# EAGLE schematic SB V1.2 (EAGLE 9.6.2)

## Sheet 1 of 2
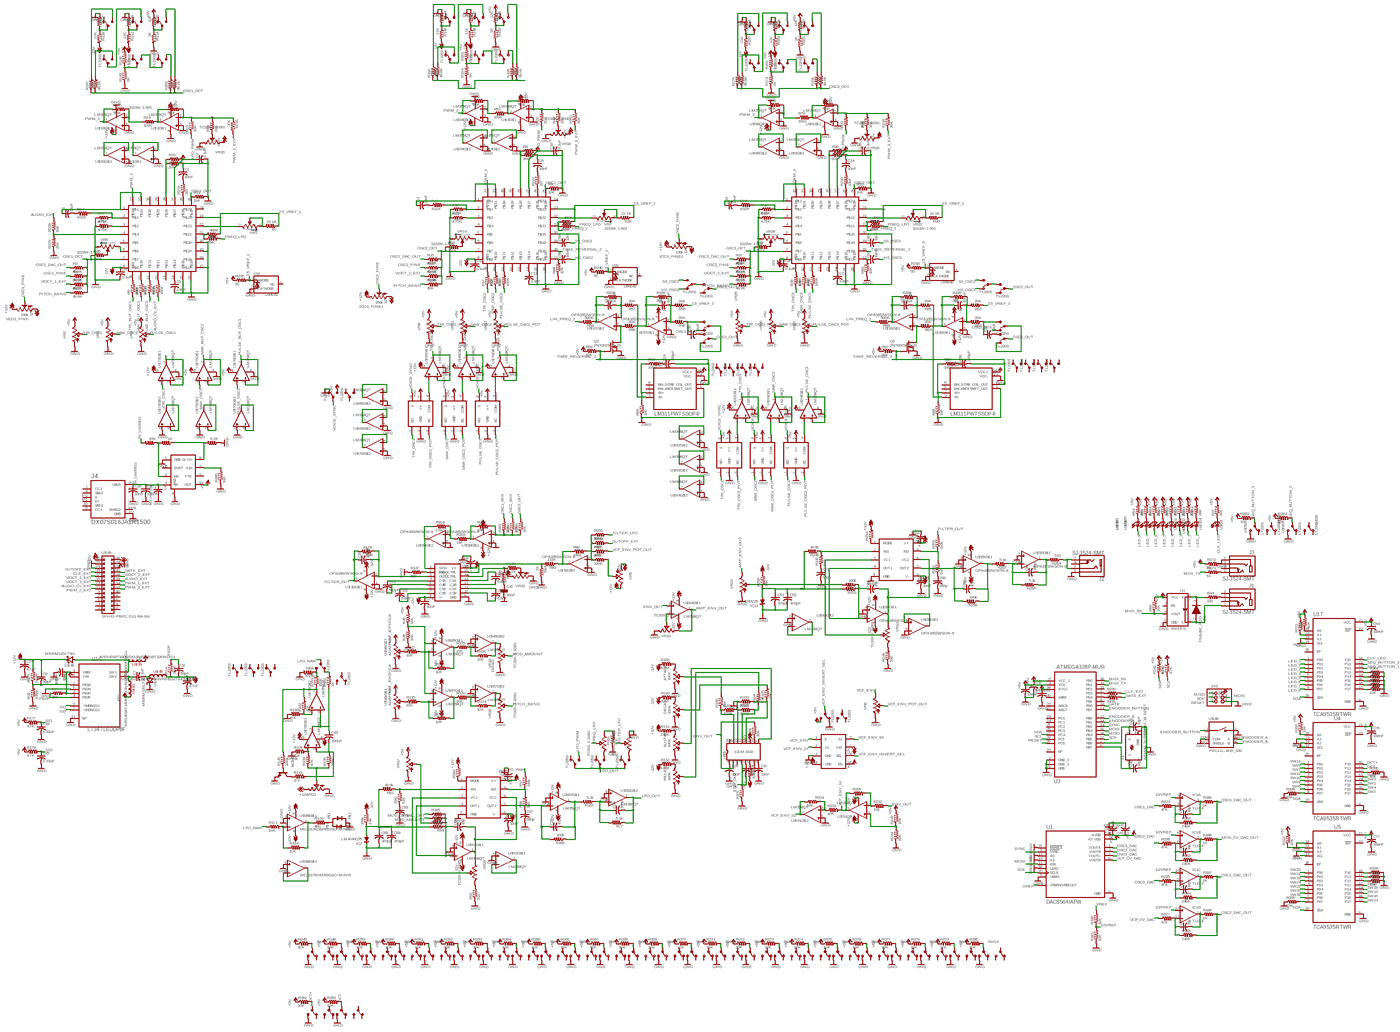
[diagram p0: schematic, sheet 1, overview]
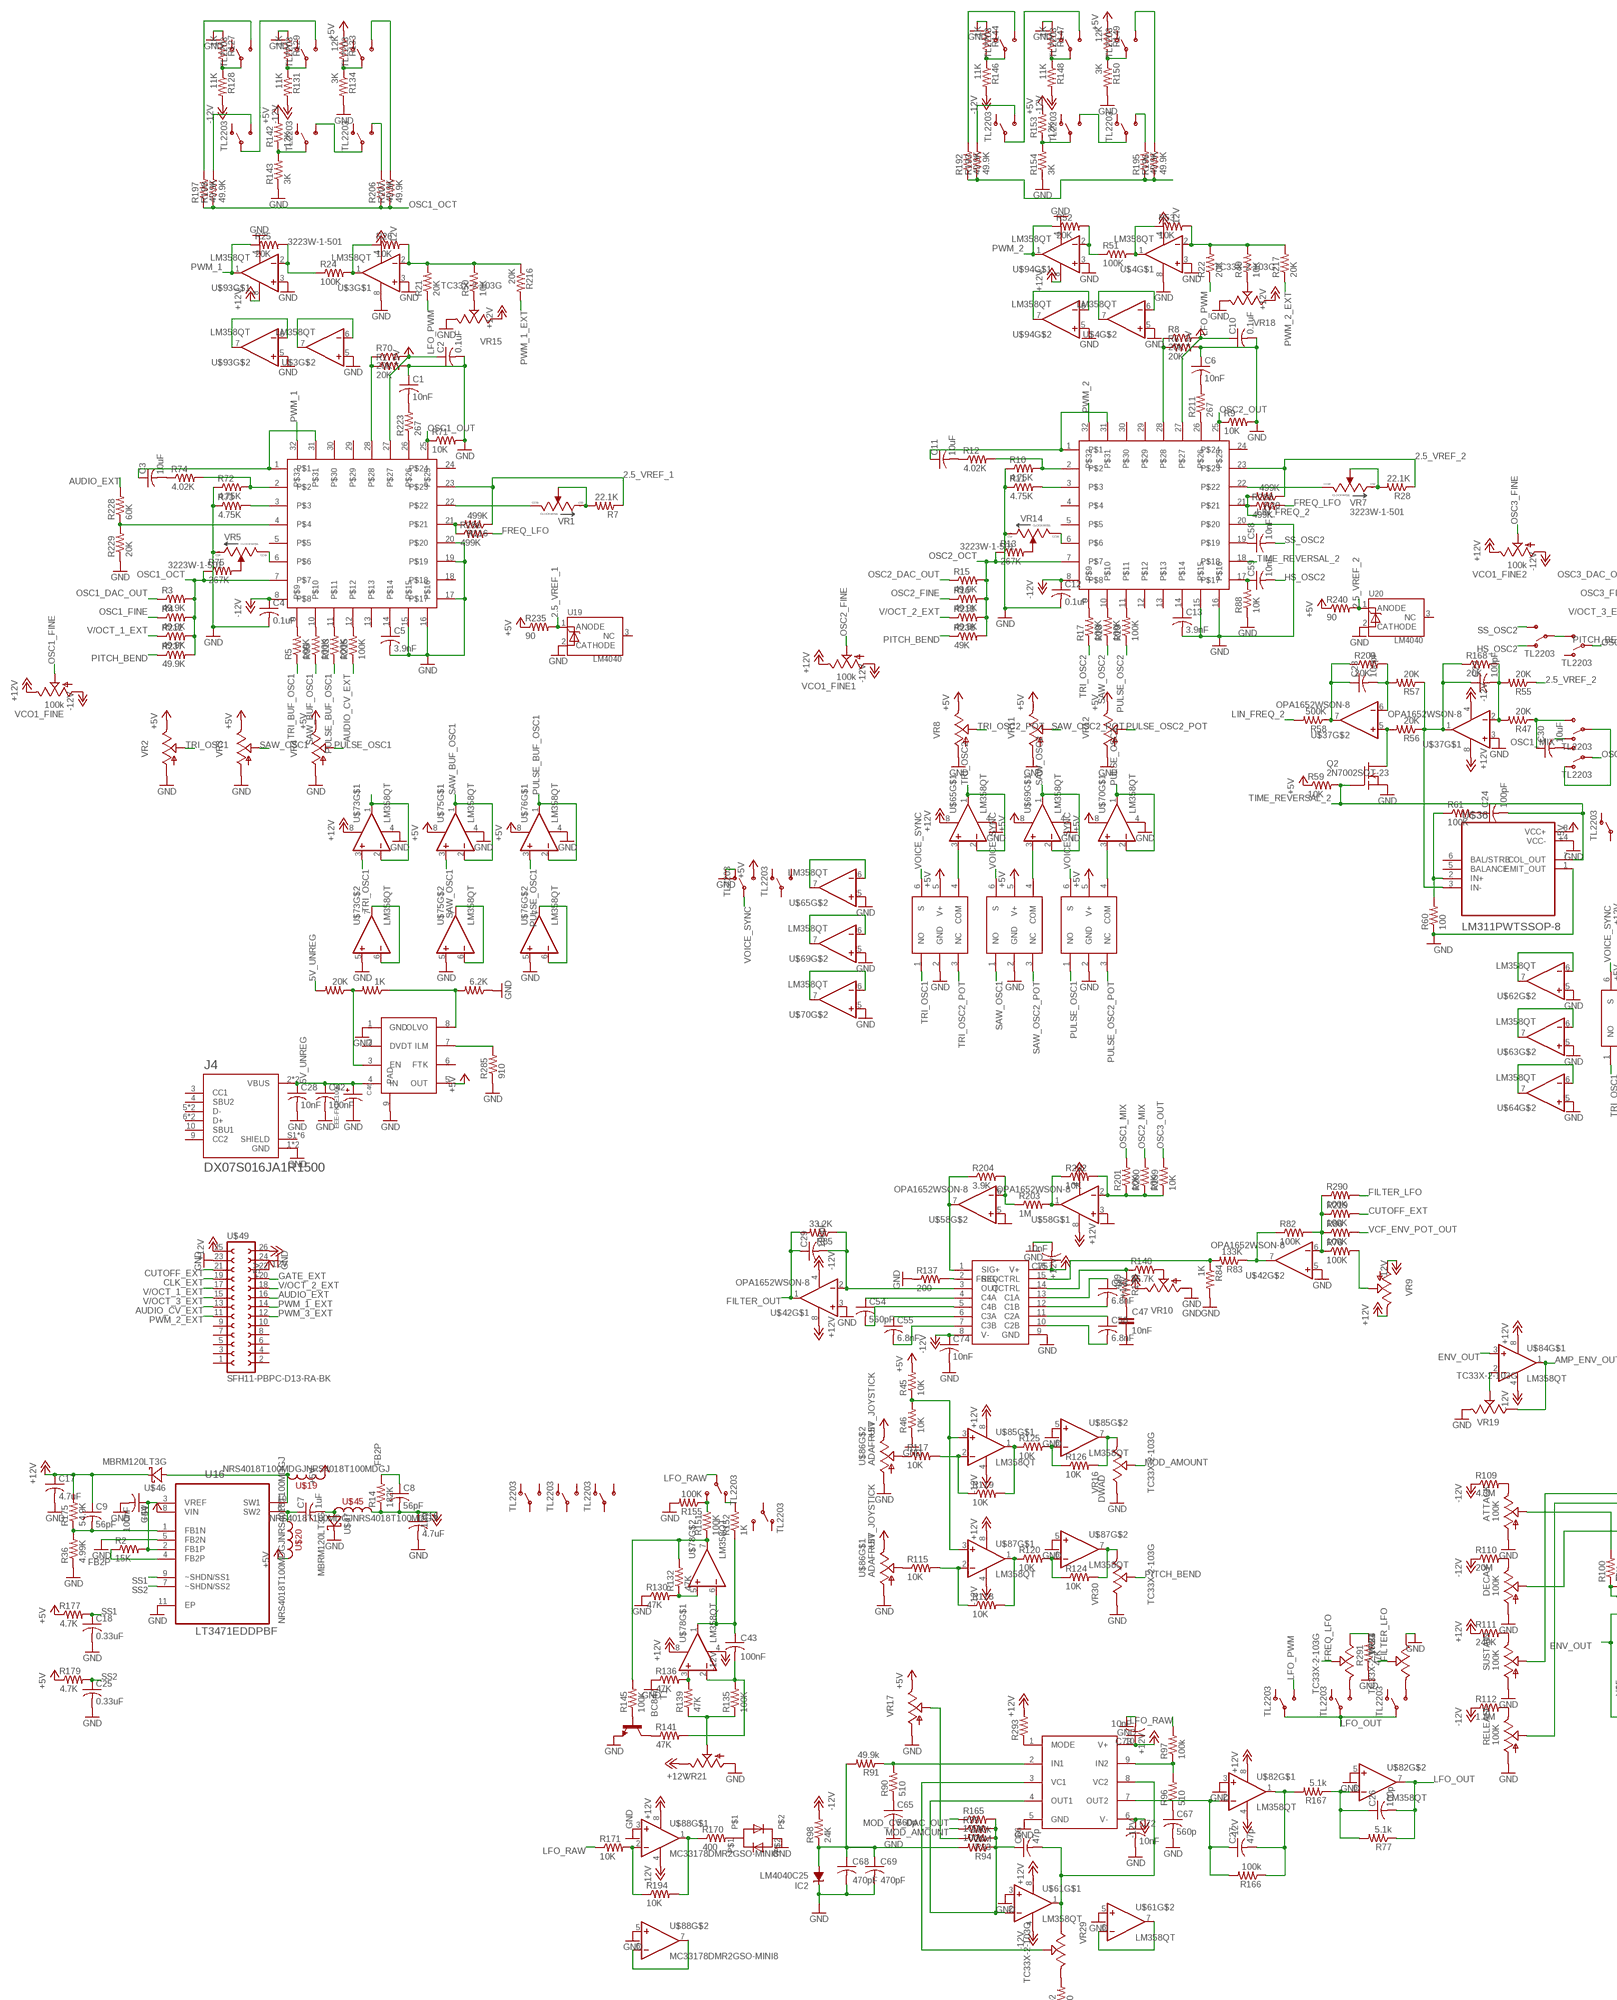
[diagram p1: schematic, sheet 1, part 1 of 4]
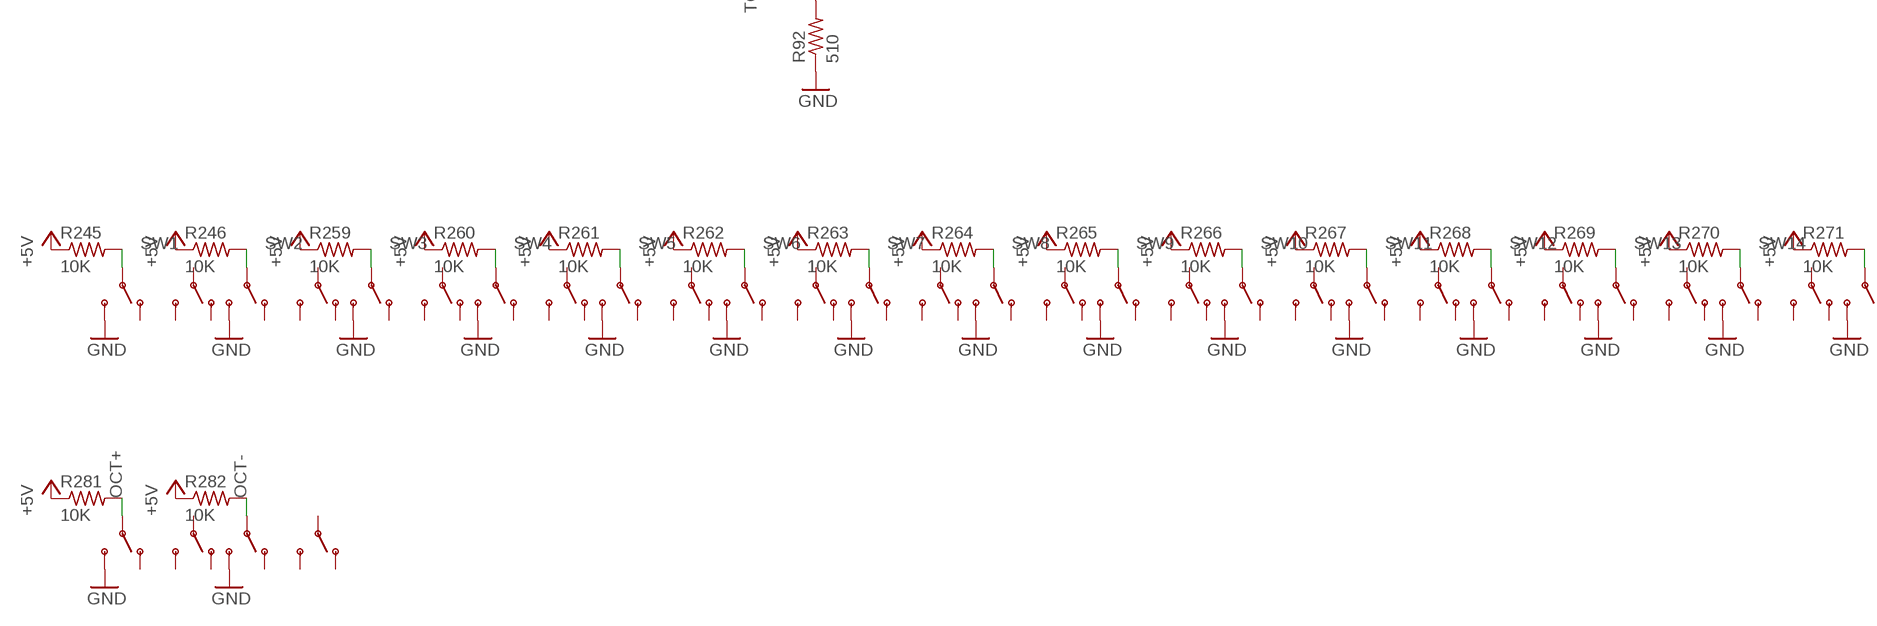
[diagram p2: schematic, sheet 1, part 2 of 4]
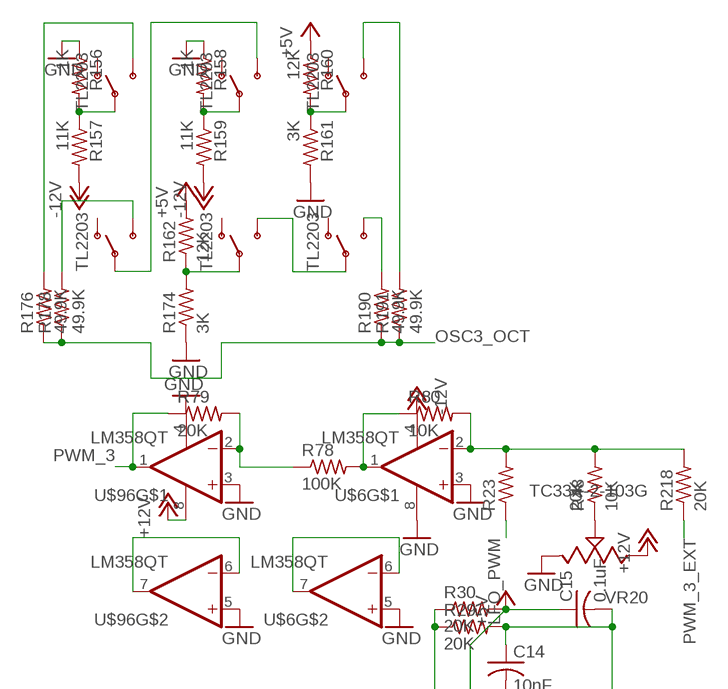
[diagram p3: schematic, sheet 1, part 3 of 4]
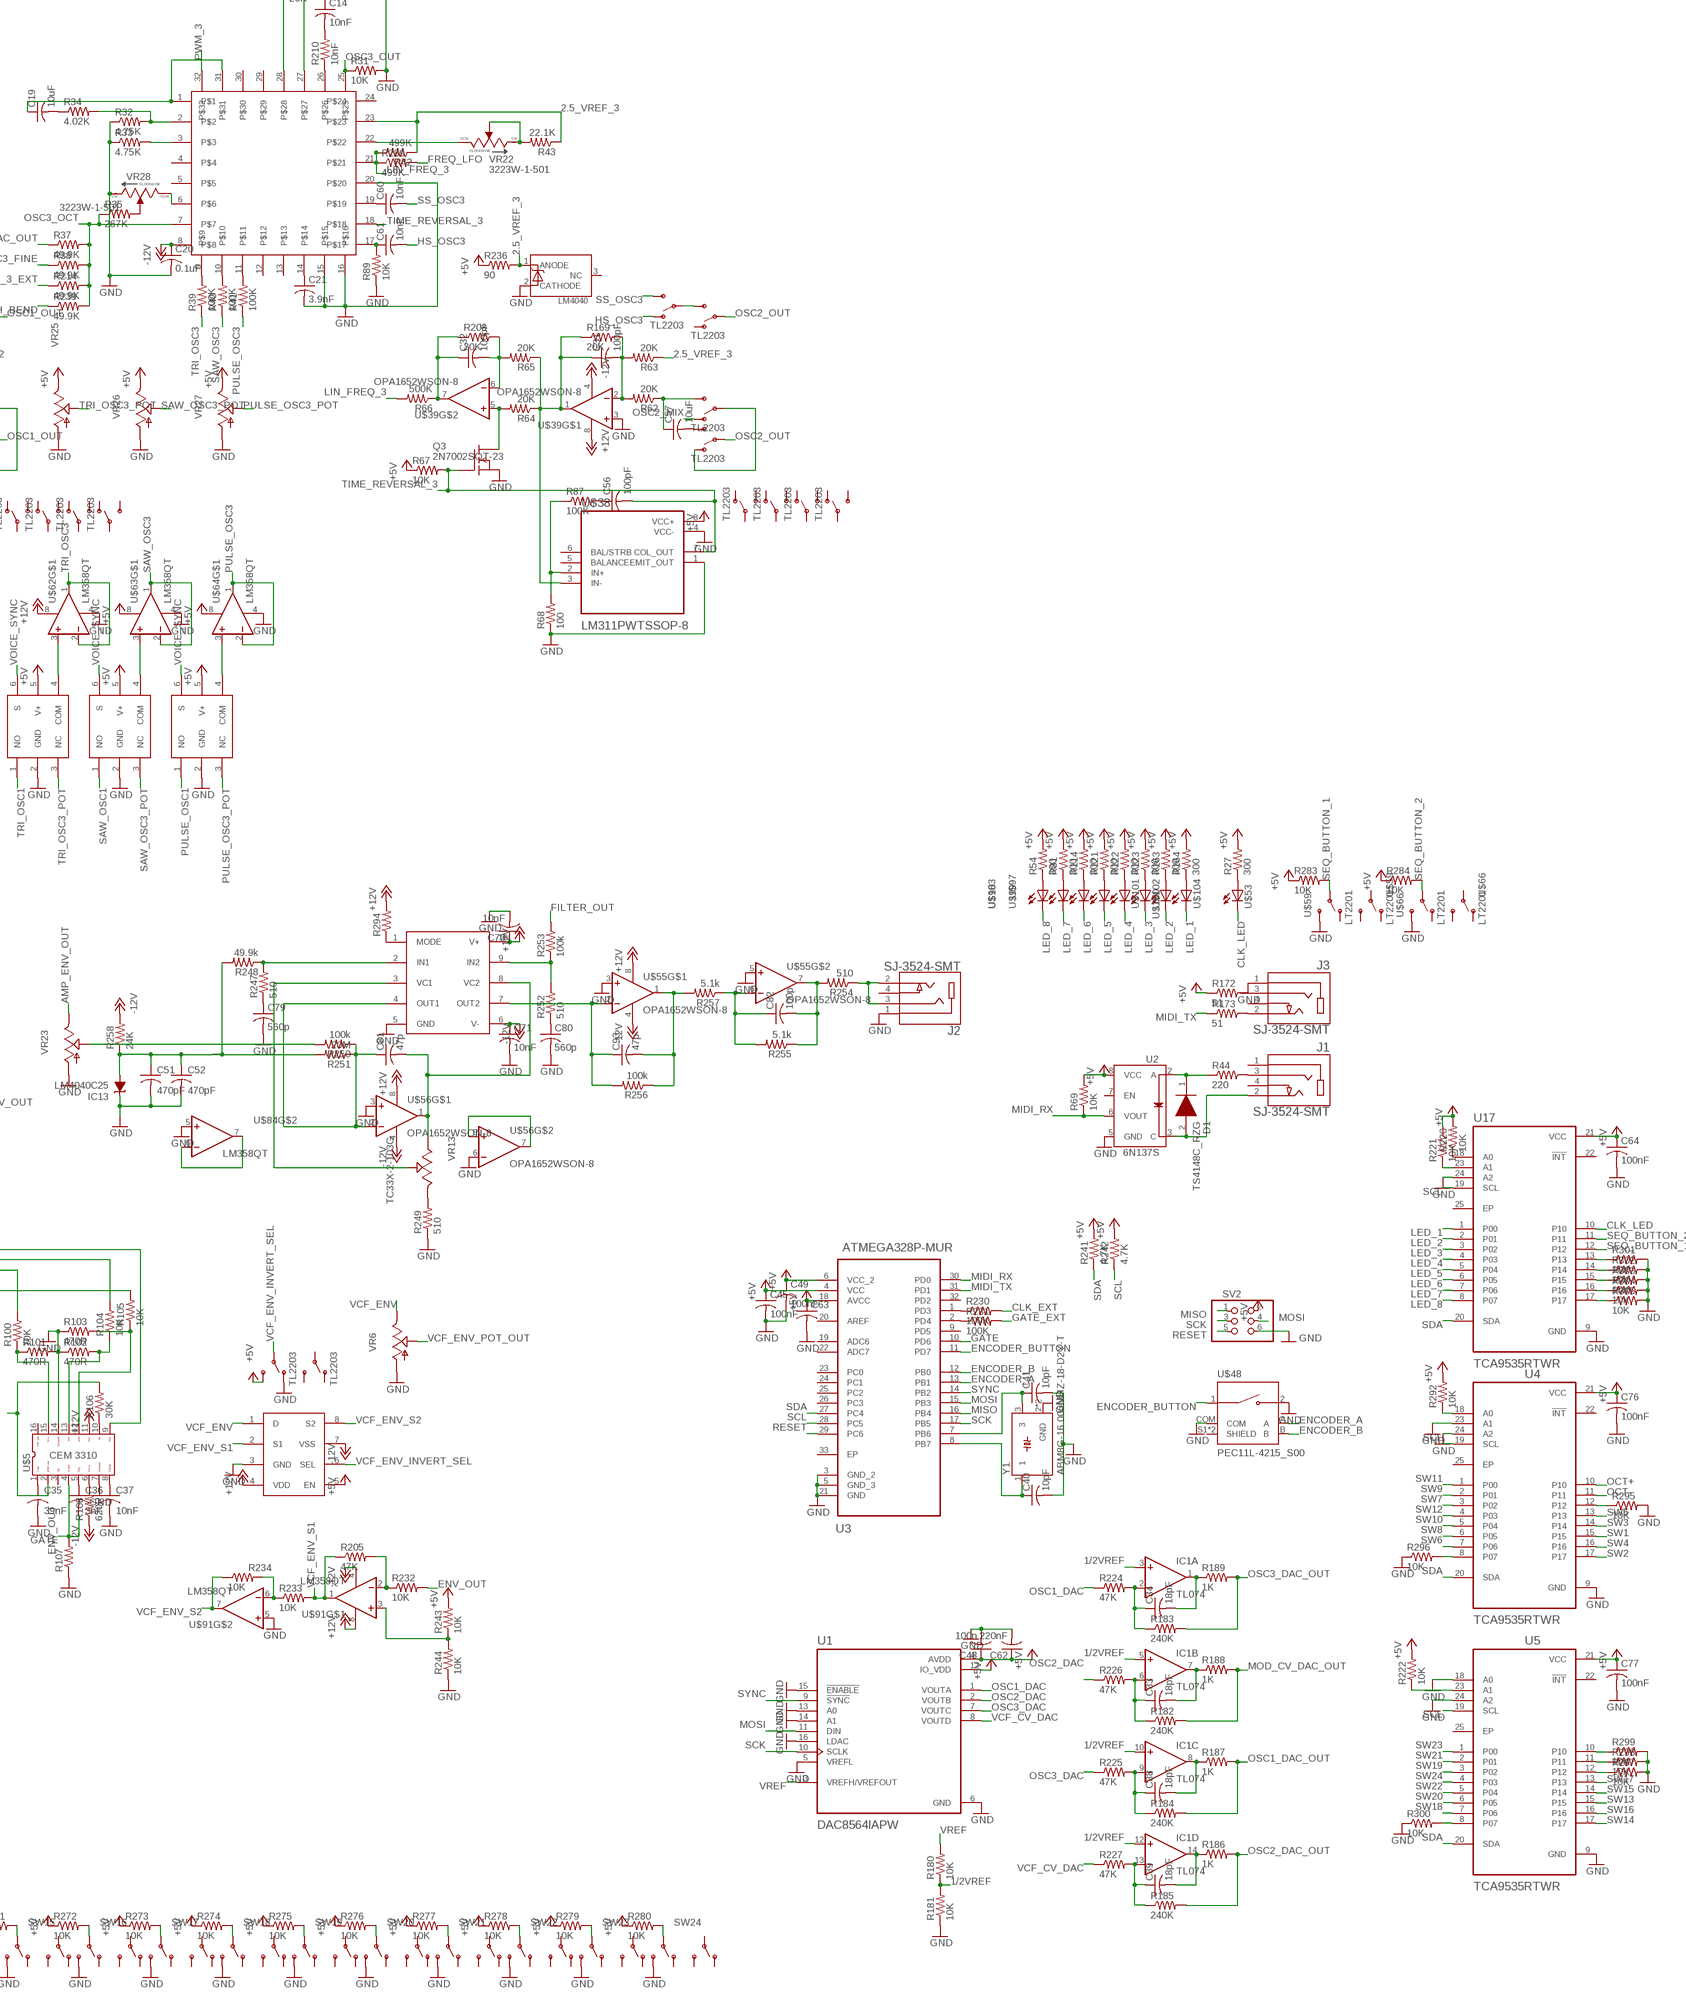
[diagram p4: schematic, sheet 1, part 4 of 4]

### Parts
1.2K  1K  R-US_R0402  [R0402]
1_DOWN  TL2203  [TL2203]
1_UP  TL2203  [TL2203]
2_DOWN  TL2203  [TL2203]
2_UP  TL2203  [TL2203]
3_DOWN  TL2203  [TL2203]
3_UP  TL2203  [TL2203]
4.3K  20K  R-US_R0402  [R0402]
ATTACK  100K  9MM_SNAP-IN_POT_NOSNAP_  [9MM_SNAP-IN_POT]
C1  10nF  C-USC0402  [C0402]
C2  0.1uF  C-USC0402  [C0402]
C3  10uF  C-USC0603  [C0603]
C4  0.1uF  C-USC0402  [C0402]
C5  3.9nF  C-USC0603  [C0603]
C6  10nF  C-USC0402  [C0402]
C7  1uF  C-USC0805  [C0805]
C8  56pF  C-USC0402  [C0402]
C9  56pF  C-USC0402  [C0402]
C10  0.1uF  C-USC0402  [C0402]
C11  10uF  C-USC0603  [C0603]
C12  0.1uF  C-USC0402  [C0402]
C13  3.9nF  C-USC0603  [C0603]
C14  10nF  C-USC0402  [C0402]
C15  0.1uF  C-USC0402  [C0402]
C16  4.7uF  C-USC1206  [C1206]
C17  4.7uF  C-USC1206  [C1206]
C18  0.33uF  C-USC0402  [C0402]
C19  10uF  C-USC0603  [C0603]
C20  0.1uF  C-USC0402  [C0402]
C21  3.9nF  C-USC0603  [C0603]
C22  100pF  C-USC0402  [C0402]
C23  100pF  C-USC0402  [C0402]
C24  100pF  C-USC0402  [C0402]
C25  0.33uF  C-USC0402  [C0402]
C26  100p  C-USC0402  [C0402]
C27  47p  C-USC0402  [C0402]
C28  10nF  C-USC0603  [C0603]
C29  100pF  C-USC0402  [C0402]
C30  10uF  C-USC0603  [C0603]
C31  100pF  C-USC0402  [C0402]
C32  100pF  C-USC0402  [C0402]
C33  18pF  C-USC0402  [C0402]
C34  18pF  C-USC0402  [C0402]
C35  39nF  C-USC0402  [C0402]
C36  3nF  C-USC0402  [C0402]
C37  10nF  C-USC0402  [C0402]
C38  18pF  C-USC0402  [C0402]
C39  18pF  C-USC0402  [C0402]
C40  10pF  C-USC0402  [C0402]
C41  10pF  C-USC0402  [C0402]
C42  100nF  C-USC0603  [C0603]
C43  100nF  C-USC0402  [C0402]
C44  100nF  C-USC0402  [C0402]
C45  100nF  C-USC0402  [C0402]
C46  EEE-FK1E100R  [CAPAE430X610N]
C47  10nF  C-EUC0402  [C0402]
C48  100n  C-USC0402  [C0402]
C49  100nF  C-USC0402  [C0402]
C50  6.8nF  C-USC0805  [C0805]
C51  470pF  C-USC0402  [C0402]
C52  470pF  C-USC0402  [C0402]
C53  6.8nF  C-USC0805  [C0805]
C54  560pF  C-USC0805  [C0805]
C55  6.8nF  C-USC0805  [C0805]
C56  100pF  C-USC0402  [C0402]
C57  10uF  C-USC0603  [C0603]
C58  10nF  C-USC0402  [C0402]
C59  10nF  C-USC0402  [C0402]
C60  10nF  C-USC0402  [C0402]
C61  10nF  C-USC0402  [C0402]
C62  220nF  C-USC0402  [C0402]
C63  C-USC0402  [C0402]
C64  100nF  C-USC0402  [C0402]
C65  560p  C-USC0402  [C0402]
C66  47p  C-USC0402  [C0402]
C67  560p  C-USC0402  [C0402]
C68  470pF  C-USC0402  [C0402]
C69  470pF  C-USC0402  [C0402]
C70  10nF  C-USC0402  [C0402]
C71  10nF  C-USC0402  [C0402]
C72  10nF  C-USC0402  [C0402]
C73  10nF  C-USC0402  [C0402]
C74  10nF  C-USC0402  [C0402]
C75  10nF  C-USC0402  [C0402]
C76  100nF  C-USC0402  [C0402]
C77  100nF  C-USC0402  [C0402]
C79  560p  C-USC0402  [C0402]
C80  560p  C-USC0402  [C0402]
C81  47p  C-USC0402  [C0402]
C82  100p  C-USC0402  [C0402]
C93  47p  C-USC0402  [C0402]
D1  TS4148C_RZG  [DIOC1608X75N]
DECAY  100K  9MM_SNAP-IN_POT_NOSNAP_  [9MM_SNAP-IN_POT]
IC1  TL074  [TSSOP14]
IC2  LM4040C25  LM4041B12DBZ  [DBZ_R-PDSO-G3]
IC13  LM4040C25  LM4041B12DBZ  [DBZ_R-PDSO-G3]
J1  SJ-3524-SMT  [CUI_SJ-3524-SMT]
J2  SJ-3524-SMT  [CUI_SJ-3524-SMT]
J3  SJ-3524-SMT  [CUI_SJ-3524-SMT]
J4  DX07S016JA1R1500  [JAE_DX07S016JA1R1500]
Q2  2N7002SOT-23  [SOT23-BEC]
Q3  2N7002SOT-23  [SOT23-BEC]
R1  20K  R-US_R0402  [R0402]
R2  15K  R-US_R0402  [R0402]
R3  49.9K  R-US_R0402  [R0402]
R4  49.9K  R-US_R0402  [R0402]
R5  100K  R-US_R0402  [R0402]
R6  20K  R-US_R0402  [R0402]
R7  22.1K  R-US_R0402  [R0402]
R8  20K  R-US_R0402  [R0402]
R9  10K  R-US_R0402  [R0402]
R10  4.75K  R-US_R0402  [R0402]
R11  4.75K  R-US_R0402  [R0402]
R12  4.02K  R-US_R0402  [R0402]
R13  267K  R-US_R0402  [R0402]
R14  182K  R-US_R0402  [R0402]
R15  49.9K  R-US_R0402  [R0402]
R16  49.9K  R-US_R0402  [R0402]
R17  100K  R-US_R0402  [R0402]
R18  100K  R-US_R0402  [R0402]
R19  100K  R-US_R0402  [R0402]
R20  499K  R-US_R0402  [R0402]
R21  20K  R-US_R0402  [R0402]
R22  20K  R-US_R0402  [R0402]
R23  20K  R-US_R0402  [R0402]
R24  100K  R-US_R0402  [R0402]
R25  20K  R-US_R0402  [R0402]
R26  10K  R-US_R0402  [R0402]
R27  300  R-US_R0603  [R0603]
R28  22.1K  R-US_R0402  [R0402]
R29  20K  R-US_R0402  [R0402]
R30  20K  R-US_R0402  [R0402]
R31  10K  R-US_R0402  [R0402]
R32  4.75K  R-US_R0402  [R0402]
R33  4.75K  R-US_R0402  [R0402]
R34  4.02K  R-US_R0402  [R0402]
R35  267K  R-US_R0402  [R0402]
R36  4.99K  R-US_R0402  [R0402]
R37  49.9K  R-US_R0402  [R0402]
R38  49.9K  R-US_R0402  [R0402]
R39  100K  R-US_R0402  [R0402]
R40  100K  R-US_R0402  [R0402]
R41  100K  R-US_R0402  [R0402]
R42  499K  R-US_R0402  [R0402]
R43  22.1K  R-US_R0402  [R0402]
R44  220  R-US_R0402  [R0402]
R45  10K  R-US_R0402  [R0402]
R46  10K  R-US_R0402  [R0402]
R47  20K  R-US_R0402  [R0402]
R48  10K  R-US_R0402  [R0402]
R49  10K  R-US_R0402  [R0402]
R50  10K  R-US_R0402  [R0402]
R51  100K  R-US_R0402  [R0402]
R52  20K  R-US_R0402  [R0402]
R53  10K  R-US_R0402  [R0402]
R54  300  R-US_R0603  [R0603]
R55  20K  R-US_R0402  [R0402]
R56  20K  R-US_R0402  [R0402]
R57  20K  R-US_R0402  [R0402]
R58  500K  R-US_R0402  [R0402]
R59  10K  R-US_R0402  [R0402]
R60  100  R-US_R0402  [R0402]
R61  100K  R-US_R0402  [R0402]
R62  20K  R-US_R0402  [R0402]
R63  20K  R-US_R0402  [R0402]
R64  20K  R-US_R0402  [R0402]
R65  20K  R-US_R0402  [R0402]
R66  500K  R-US_R0402  [R0402]
R67  10K  R-US_R0402  [R0402]
R68  100  R-US_R0402  [R0402]
R69  10K  R-US_R0402  [R0402]
R70  20K  R-US_R0402  [R0402]
R71  10K  R-US_R0402  [R0402]
R72  4.75K  R-US_R0402  [R0402]
R73  4.75K  R-US_R0402  [R0402]
R74  4.02K  R-US_R0402  [R0402]
R75  267K  R-US_R0402  [R0402]
R76  100K  R-US_R0402  [R0402]
R77  5.1k  R-US_R0402  [R0402]
R78  100K  R-US_R0402  [R0402]
R79  20K  R-US_R0402  [R0402]
R80  10K  R-US_R0402  [R0402]
R81  300  R-US_R0603  [R0603]
R82  100K  R-US_R0402  [R0402]
R83  133K  R-US_R0402  [R0402]
R84  1K  R-US_R0402  [R0402]
R85  33.2K  R-US_R0402  [R0402]
R86  100K  R-US_R0402  [R0402]
R87  100K  R-US_R0402  [R0402]
R88  10K  R-US_R0402  [R0402]
R89  10K  R-US_R0402  [R0402]
R90  510  R-US_R0402  [R0402]
R91  49.9k  R-US_R0402  [R0402]
R92  510  R-US_R0402  [R0402]
R93  100k  R-US_R0402  [R0402]
R94  20M  R-US_R0402  [R0402]
R95  100K  R-US_R0402  [R0402]
R96  510  R-US_R0402  [R0402]
R97  100k  R-US_R0402  [R0402]
R98  24K  R-US_R0402  [R0402]
R99  100K  R-US_R0402  [R0402]
R100  10K  R-US_R0402  [R0402]
R101  470R  R-US_R0402  [R0402]
R102  470R  R-US_R0402  [R0402]
R103  470R  R-US_R0402  [R0402]
R104  10K  R-US_R0402  [R0402]
R105  10K  R-US_R0402  [R0402]
R106  30K  R-US_R0402  [R0402]
R107  10K  R-US_R0402  [R0402]
R108  620R  R-US_R0402  [R0402]
R109  4.3M  R-US_R0402  [R0402]
R110  20M  R-US_R0402  [R0402]
R111  240K  R-US_R0402  [R0402]
R112  1.8M  R-US_R0402  [R0402]
R113  100K  R-US_R0402  [R0402]
R114  300  R-US_R0603  [R0603]
R115  10K  R-US_R0402  [R0402]
R116  499K  R-US_R0402  [R0402]
R117  10K  R-US_R0402  [R0402]
R118  10K  R-US_R0402  [R0402]
R119  10K  R-US_R0402  [R0402]
R120  10K  R-US_R0402  [R0402]
R121  300  R-US_R0603  [R0603]
R122  300  R-US_R0603  [R0603]
R123  300  R-US_R0603  [R0603]
R124  10K  R-US_R0402  [R0402]
R125  10K  R-US_R0402  [R0402]
R126  10K  R-US_R0402  [R0402]
R127  1K  R-US_R0402  [R0402]
R128  11K  R-US_R0402  [R0402]
R129  1K  R-US_R0402  [R0402]
R130  47K  R-US_R0402  [R0402]
R131  11K  R-US_R0402  [R0402]
R132  47K  R-US_R0402  [R0402]
R133  12K  R-US_R0402  [R0402]
R134  3K  R-US_R0402  [R0402]
R135  100K  R-US_R0402  [R0402]
R136  47K  R-US_R0402  [R0402]
R137  200  R-US_R0402  [R0402]
R138  499  R-US_R0402  [R0402]
R139  47K  R-US_R0402  [R0402]
R140  26.7K  R-US_R0402  [R0402]
R141  47K  R-US_R0402  [R0402]
R142  12K  R-US_R0402  [R0402]
R143  3K  R-US_R0402  [R0402]
R144  1K  R-US_R0402  [R0402]
R145  100K  R-US_R0402  [R0402]
R146  11K  R-US_R0402  [R0402]
R147  1K  R-US_R0402  [R0402]
R148  11K  R-US_R0402  [R0402]
R149  12K  R-US_R0402  [R0402]
R150  3K  R-US_R0402  [R0402]
R151  100K  R-US_R0402  [R0402]
R152  1K  R-US_R0402  [R0402]
R153  12K  R-US_R0402  [R0402]
R154  3K  R-US_R0402  [R0402]
R155  100K  R-US_R0402  [R0402]
R156  1K  R-US_R0402  [R0402]
R157  11K  R-US_R0402  [R0402]
R158  1K  R-US_R0402  [R0402]
R159  11K  R-US_R0402  [R0402]
R160  12K  R-US_R0402  [R0402]
R161  3K  R-US_R0402  [R0402]
R162  12K  R-US_R0402  [R0402]
R163  300  R-US_R0603  [R0603]
R164  300  R-US_R0603  [R0603]
R165  100K  R-US_R0402  [R0402]
R166  100k  R-US_R0402  [R0402]
R167  5.1k  R-US_R0402  [R0402]
R168  20K  R-US_R0402  [R0402]
R169  20K  R-US_R0402  [R0402]
R170  400  R-US_R0603  [R0603]
R171  10K  R-US_R0402  [R0402]
R172  51  R-US_R0402  [R0402]
R173  51  R-US_R0402  [R0402]
R174  3K  R-US_R0402  [R0402]
R175  54.9K  R-US_R0402  [R0402]
R176  49.9K  R-US_R0402  [R0402]
R177  4.7K  R-US_R0402  [R0402]
R178  49.9K  R-US_R0402  [R0402]
R179  4.7K  R-US_R0402  [R0402]
R180  10K  R-US_R0402  [R0402]
R181  10K  R-US_R0402  [R0402]
R182  240K  R-US_R0402  [R0402]
R183  240K  R-US_R0402  [R0402]
R184  240K  R-US_R0402  [R0402]
R185  240K  R-US_R0402  [R0402]
R186  1K  R-US_R0402  [R0402]
R187  1K  R-US_R0402  [R0402]
R188  1K  R-US_R0402  [R0402]
R189  1K  R-US_R0402  [R0402]
R190  49.9K  R-US_R0402  [R0402]
R191  49.9K  R-US_R0402  [R0402]
R192  49.9K  R-US_R0402  [R0402]
R193  49.9K  R-US_R0402  [R0402]
R194  10K  R-US_R0402  [R0402]
R195  49.9K  R-US_R0402  [R0402]
R196  49.9K  R-US_R0402  [R0402]
R197  49.9K  R-US_R0402  [R0402]
R198  49.9K  R-US_R0402  [R0402]
R199  10K  R-US_R0402  [R0402]
R200  10K  R-US_R0402  [R0402]
R201  10K  R-US_R0402  [R0402]
R202  10K  R-US_R0402  [R0402]
R203  1M  R-US_R0402  [R0402]
R204  3.9K  R-US_R0402  [R0402]
R205  47K  R-US_R0402  [R0402]
R206  49.9K  R-US_R0402  [R0402]
R207  49.9K  R-US_R0402  [R0402]
R208  20K  R-US_R0402  [R0402]
R209  20K  R-US_R0402  [R0402]
R210  10nF  R-US_R0402  [R0402]
R211  267  R-US_R0402  [R0402]
R212  49.9K  R-US_R0402  [R0402]
R213  49.9K  R-US_R0402  [R0402]
R214  49.9K  R-US_R0402  [R0402]
R215  100K  R-US_R0402  [R0402]
R216  20K  R-US_R0402  [R0402]
R217  20K  R-US_R0402  [R0402]
R218  20K  R-US_R0402  [R0402]
R219  100K  R-US_R0402  [R0402]
R220  10K  R-US_R0402  [R0402]
R221  10K  R-US_R0402  [R0402]
R222  10K  R-US_R0402  [R0402]
R223  267  R-US_R0402  [R0402]
R224  47K  R-US_R0402  [R0402]
R225  47K  R-US_R0402  [R0402]
R226  47K  R-US_R0402  [R0402]
R227  47K  R-US_R0402  [R0402]
R228  60K  R-US_R0402  [R0402]
R229  20K  R-US_R0402  [R0402]
R230  100K  R-US_R0402  [R0402]
R231  100K  R-US_R0402  [R0402]
R232  10K  R-US_R0402  [R0402]
R233  10K  R-US_R0402  [R0402]
R234  10K  R-US_R0402  [R0402]
R235  90  R-US_R0402  [R0402]
R236  90  R-US_R0402  [R0402]
R237  49.9K  R-US_R0402  [R0402]
R238  49K  R-US_R0402  [R0402]
R239  49.9K  R-US_R0402  [R0402]
R240  90  R-US_R0402  [R0402]
R241  4.7K  R-US_R0402  [R0402]
R242  4.7K  R-US_R0402  [R0402]
R243  10K  R-US_R0402  [R0402]
R244  10K  R-US_R0402  [R0402]
R245  10K  R-US_R0402  [R0402]
R246  10K  R-US_R0402  [R0402]
R247  510  R-US_R0402  [R0402]
R248  49.9k  R-US_R0402  [R0402]
R249  510  R-US_R0402  [R0402]
R250  100k  R-US_R0402  [R0402]
R251  20M  R-US_R0402  [R0402]
R252  510  R-US_R0402  [R0402]
R253  100k  R-US_R0402  [R0402]
R254  510  R-US_R0402  [R0402]
R255  5.1k  R-US_R0402  [R0402]
R256  100k  R-US_R0402  [R0402]
R257  5.1k  R-US_R0402  [R0402]
R258  24K  R-US_R0402  [R0402]
R259  10K  R-US_R0402  [R0402]
R260  10K  R-US_R0402  [R0402]
R261  10K  R-US_R0402  [R0402]
R262  10K  R-US_R0402  [R0402]
R263  10K  R-US_R0402  [R0402]
R264  10K  R-US_R0402  [R0402]
R265  10K  R-US_R0402  [R0402]
R266  10K  R-US_R0402  [R0402]
R267  10K  R-US_R0402  [R0402]
R268  10K  R-US_R0402  [R0402]
R269  10K  R-US_R0402  [R0402]
R270  10K  R-US_R0402  [R0402]
R271  10K  R-US_R0402  [R0402]
R272  10K  R-US_R0402  [R0402]
R273  10K  R-US_R0402  [R0402]
R274  10K  R-US_R0402  [R0402]
R275  10K  R-US_R0402  [R0402]
R276  10K  R-US_R0402  [R0402]
R277  10K  R-US_R0402  [R0402]
R278  10K  R-US_R0402  [R0402]
R279  10K  R-US_R0402  [R0402]
R280  10K  R-US_R0402  [R0402]
R281  10K  R-US_R0402  [R0402]
R282  10K  R-US_R0402  [R0402]
R283  10K  R-US_R0402  [R0402]
R284  10K  R-US_R0402  [R0402]
R285  910  R-US_R0402  [R0402]
R286  499K  R-US_R0402  [R0402]
R287  6.2K  R-US_R0402  [R0402]
R288  499K  R-US_R0402  [R0402]
R289  499K  R-US_R0402  [R0402]
R290  100K  R-US_R0402  [R0402]
R291  47K  R-US_R0402  [R0402]
R292  10K  R-US_R0402  [R0402]
R293  R-US_R0402  [R0402]
R294  R-US_R0402  [R0402]
R295  10K  R-US_R0402  [R0402]
R296  10K  R-US_R0402  [R0402]
R297  10K  R-US_R0402  [R0402]
R298  10K  R-US_R0402  [R0402]
R299  10K  R-US_R0402  [R0402]
R300  10K  R-US_R0402  [R0402]
R301  10K  R-US_R0402  [R0402]
R302  10K  R-US_R0402  [R0402]
R303  10K  R-US_R0402  [R0402]
R304  10K  R-US_R0402  [R0402]
R305  10K  R-US_R0402  [R0402]
RELEASE  100K  9MM_SNAP-IN_POT_NOSNAP_  [9MM_SNAP-IN_POT]
SUSTAIN  100K  9MM_SNAP-IN_POT_NOSNAP_  [9MM_SNAP-IN_POT]
SV2  PINHD-2X3  [2X03]
T1  BC847  [SOT23]
U1  DAC8564IAPW  [SOP65P640X120-16N]
U2  6N137S  [8-SMD]
U3  ATMEGA328P-MUR  [QFN50P500X500X100-33N]
U4  TCA9535RTWR  [QFN50P400X400X80-25N]
U5  TCA9535RTWR  [QFN50P400X400X80-25N]
U16  LT3471EDDPBF  [DFN300X300X80-11N]
U17  TCA9535RTWR  [QFN50P400X400X80-25N]
U19  LM4040  [SOT23-3]
U20  LM4040  [SOT23-3]
U21  LM4040  [SOT23-3]
U$1  SSI2130_V2QFN-32  [QFN40P400X400X80-33T270N]
U$2  SSI2130_V2QFN-32  [QFN40P400X400X80-33T270N]
U$3  LM358QT  [SON50P200X200X60-9N]
U$4  LM358QT  [SON50P200X200X60-9N]
U$5  AS3310DSO-16  [SO16]
U$6  LM358QT  [SON50P200X200X60-9N]
U$7  SSI2130_V2QFN-32  [QFN40P400X400X80-33T270N]
U$8  TL2203  [TL2203]
U$9  LT2201  [LT2201]
U$10  LT2201  [LT2201]
U$11  LT2201  [LT2201]
U$12  LT2201  [LT2201]
U$13  LT2201  [LT2201]
U$14  LT2201  [LT2201]
U$15  LT2201  [LT2201]
U$16  LT2201  [LT2201]
U$17  LT2201  [LT2201]
U$18  LT2201  [LT2201]
U$19  NRS4018T100MDGJNRS4018T100MDGJ  [INDDFN400X400X180-2N]
U$20  NRS4018T100MDGJNRS4018T100MDGJ  [INDDFN400X400X180-2N]
U$21  LT2201  [LT2201]
U$22  LT2201  [LT2201]
U$23  LT2201  [LT2201]
U$24  LT2201  [LT2201]
U$25  LT2201  [LT2201]
U$26  LT2201  [LT2201]
U$27  LT2201  [LT2201]
U$28  LT2201  [LT2201]
U$29  LT2201  [LT2201]
U$30  LT2201  [LT2201]
U$31  LT2201  [LT2201]
U$32  LT2201  [LT2201]
U$33  LT2201  [LT2201]
U$34  LT2201  [LT2201]
U$35  TL2203  [TL2203]
U$36  LM311PWTSSOP-8  [TSSOP8]
U$37  OPA1652WSON-8  [SON50P300X300X80-9T120X200N]
U$38  LM311PWTSSOP-8  [TSSOP8]
U$39  OPA1652WSON-8  [SON50P300X300X80-9T120X200N]
U$40  TL2203  [TL2203]
U$41  TL2203  [TL2203]
U$42  OPA1652WSON-8  [SON50P300X300X80-9T120X200N]
U$43  TL2203  [TL2203]
U$44  TL2203  [TL2203]
U$45  NRS4018T100MDGJNRS4018T100MDGJ  [INDDFN400X400X180-2N]
U$46  MBRM120LT3G  [DIO_MBRM110LT1G]
U$47  MBRM120LT3G  [DIO_MBRM110LT1G]
U$48  PEC11L-4215_S00  [XDCR_PEC11R-4215F-S0024]
U$49  SFH11-PBPC-D13-RA-BK  [FE13-2W]
U$51  TL2203  [TL2203]
U$53  WP914HDT  [WP914HDT]
U$54  SSI2162SSOP10  [SOP100P600X150-10N]
U$55  OPA1652WSON-8  [SON50P300X300X80-9T120X200N]
U$56  OPA1652WSON-8  [SON50P300X300X80-9T120X200N]
U$57  TL2203  [TL2203]
U$58  OPA1652WSON-8  [SON50P300X300X80-9T120X200N]
U$59  LT2201  [LT2201]
U$60  TL2203  [TL2203]
U$61  LM358QT  [SON50P200X200X60-9N]
U$62  LM358QT  [SON50P200X200X60-9N]
U$63  LM358QT  [SON50P200X200X60-9N]
U$64  LM358QT  [SON50P200X200X60-9N]
U$65  LM358QT  [SON50P200X200X60-9N]
U$66  LT2201  [LT2201]
U$67  LT2201  [LT2201]
U$68  LT2201  [LT2201]
U$69  LM358QT  [SON50P200X200X60-9N]
U$70  LM358QT  [SON50P200X200X60-9N]
U$71  TL2203  [TL2203]
U$72  TL2203  [TL2203]
U$73  LM358QT  [SON50P200X200X60-9N]
U$74  WP483SRSGW  [WP483SRSGW]
U$75  LM358QT  [SON50P200X200X60-9N]
U$76  LM358QT  [SON50P200X200X60-9N]
U$77  TL2203  [TL2203]
U$78  LM358QT  [SON50P200X200X60-9N]
U$79  TL2203  [TL2203]
U$80  TL2203  [TL2203]
U$81  TL2203  [TL2203]
U$82  LM358QT  [SON50P200X200X60-9N]
U$83  SSI2144  [TSSOP16]
U$84  LM358QT  [SON50P200X200X60-9N]
U$85  LM358QT  [SON50P200X200X60-9N]
U$86  ADAFRUIT_JOYSTICK  [ADAFRUIT-JOYSTICK]
U$87  LM358QT  [SON50P200X200X60-9N]
U$88  MC33178DMR2GSO-MINI8  [SOP65P490X110-8N]
U$89  TMUX6219DGKRSO-MINI8  [SOP65P490X110-8N]
U$90  SSI2162SSOP10  [SOP100P600X150-10N]
U$91  LM358QT  [SON50P200X200X60-9N]
U$92  TL2203  [TL2203]
U$93  LM358QT  [SON50P200X200X60-9N]
U$94  LM358QT  [SON50P200X200X60-9N]
U$95  TL2203  [TL2203]
U$96  LM358QT  [SON50P200X200X60-9N]
U$97  WP914HDT  [WP914HDT]
U$98  WP914HDT  [WP914HDT]
U$99  WP914HDT  [WP914HDT]
U$100  WP914HDT  [WP914HDT]
U$101  WP914HDT  [WP914HDT]
U$102  WP914HDT  [WP914HDT]
U$103  WP914HDT  [WP914HDT]
U$104  WP914HDT  [WP914HDT]
U$105  NC7SB3157P6XSC-70-6  [SOT65P210X110-6N]
U$106  NC7SB3157P6XSC-70-6  [SOT65P210X110-6N]
U$107  NC7SB3157P6XSC-70-6  [SOT65P210X110-6N]
U$108  NC7SB3157P6XSC-70-6  [SOT65P210X110-6N]
U$109  NC7SB3157P6XSC-70-6  [SOT65P210X110-6N]
U$110  NC7SB3157P6XSC-70-6  [SOT65P210X110-6N]
U$111  TPS259620DDARSOIC-8  [SOIC127P600X170-9T240X310N]
VCO1_FINE  100k  9MM_SNAP-IN_POT_NOSNAP_  [9MM_SNAP-IN_POT]
VCO1_FINE1  100k  9MM_SNAP-IN_POT_NOSNAP_  [9MM_SNAP-IN_POT]
VCO1_FINE2  100k  9MM_SNAP-IN_POT_NOSNAP_  [9MM_SNAP-IN_POT]
VR1  3223W-1-501  [TRIM_3223W-1-501]
VR2  9MM_SNAP-IN_POT_  [9MM_SNAP-IN_POT]
VR3  9MM_SNAP-IN_POT_  [9MM_SNAP-IN_POT]
VR4  9MM_SNAP-IN_POT_  [9MM_SNAP-IN_POT]
VR5  3223W-1-501  [TRIM_3223W-1-501]
VR6  9MM_SNAP-IN_POT_  [9MM_SNAP-IN_POT]
VR7  3223W-1-501  [TRIM_3223W-1-501]
VR8  9MM_SNAP-IN_POT_  [9MM_SNAP-IN_POT]
VR9  9MM_SNAP-IN_POT_  [9MM_SNAP-IN_POT]
VR10  9MM_SNAP-IN_POT_  [9MM_SNAP-IN_POT]
VR11  9MM_SNAP-IN_POT_  [9MM_SNAP-IN_POT]
VR12  9MM_SNAP-IN_POT_  [9MM_SNAP-IN_POT]
VR13  TC33X-2-103G  [TRIMMER_TC33X-2-103G]
VR14  3223W-1-501  [TRIM_3223W-1-501]
VR15  TC33X-2-103G  [TRIMMER_TC33X-2-103G]
VR16  TC33X-2-103G  [TRIMMER_TC33X-2-103G]
VR17  9MM_SNAP-IN_POT_  [9MM_SNAP-IN_POT]
VR18  TC33X-2-103G  [TRIMMER_TC33X-2-103G]
VR19  TC33X-2-103G  [TRIMMER_TC33X-2-103G]
VR20  TC33X-2-103G  [TRIMMER_TC33X-2-103G]
VR21  9MM_SNAP-IN_POT_NOSNAP_  [9MM_SNAP-IN_POT]
VR22  3223W-1-501  [TRIM_3223W-1-501]
VR23  9MM_SNAP-IN_POT_  [9MM_SNAP-IN_POT]
VR24  TC33X-2-103G  [TRIMMER_TC33X-2-103G]
VR25  9MM_SNAP-IN_POT_  [9MM_SNAP-IN_POT]
VR26  9MM_SNAP-IN_POT_  [9MM_SNAP-IN_POT]
VR27  9MM_SNAP-IN_POT_  [9MM_SNAP-IN_POT]
VR28  3223W-1-501  [TRIM_3223W-1-501]
VR29  TC33X-2-103G  [TRIMMER_TC33X-2-103G]
VR30  TC33X-2-103G  [TRIMMER_TC33X-2-103G]
VR31  TC33X-2-103G  [TRIMMER_TC33X-2-103G]
Y1  ABM8G-16.000MHZ-18-D2Y-T  [OSCSC320X250X100N]

### Nets
1/2VREF: IC1.3(A:+IN) IC1.5(B:+IN) IC1.10(C:+IN) IC1.12(D:+IN) R180.1 R181.2
2.5_VREF_1: R7.1 R116.1 R235.2 U19.1(ANODE) U$7.23
2.5_VREF_2: R20.1 R28.1 R55.1 R240.2 U20.1(ANODE) U$1.23
2.5_VREF_3: R42.1 R43.1 R63.1 R236.2 U21.1(ANODE) U$2.23
5V_UNREG: 4.3K.2 C28.1 C42.1 C46.1 J4.2(VBUS) J4.11(VBUS) U$111.4(IN)
+5V: C2.1 C10.1 C15.1 C45.1 C48.1 C49.1 C62.1 C63.1 C64.1 C76.1 C77.1 R8.2 R27.2 R30.2 R45.2 R54.2 R59.1 R67.1 R69.2 R70.2 R81.2 R114.2 R121.2 R122.2 R123.2 R133.1 R142.2 R149.1 R153.2 R160.1 R162.2 R163.2 R164.2 R172.1 R177.1 R179.1 R220.2 R221.2 R222.2 R235.1 R236.1 R240.1 R241.2 R242.2 R243.2 R245.1 R246.1 R259.1 R260.1 R261.1 R262.1 R263.1 R264.1 R265.1 R266.1 R267.1 R268.1 R269.1 R270.1 R271.1 R272.1 R273.1 R274.1 R275.1 R276.1 R277.1 R278.1 R279.1 R280.1 R281.1 R282.1 R283.1 R284.1 R292.2 SV2.2 U1.4(AVDD) U1.12(IO_VDD) U2.8(VCC) U3.4(VCC) U3.6(VCC_2) U3.18(AVCC) U4.21(VCC) U5.21(VCC) U16.8(VIN) U17.21(VCC) U$1.27 U$2.27 U$7.27 U$19.1 U$20.2 U$36.8(VCC+) U$38.8(VCC+) U$49.22 U$63.8(V+) U$64.8(V+) U$69.8(V+) U$70.8(V+) U$71.P$1(S1) U$72.P$1(S1) U$75.8(V+) U$76.8(V+) U$86.P$1(E) U$86.P$4(E) U$89.5(EN) U$105.5(V+) U$106.5(V+) U$107.5(V+) U$108.5(V+) U$109.5(V+) U$110.5(V+) U$111.5(OUT) VR2.3(E) VR3.3(E) VR4.3(E) VR8.3(E) VR11.3(E) VR12.3(E) VR17.3(E) VR25.3(E) VR26.3(E) VR27.3(E)
+12V: C9.1 C17.1 C70.1 C73.1 C75.1 R111.1 R175.2 R293.2 R294.2 U$5.11 U$37.8(V+) U$39.8(V+) U$42.8(V+) U$46.1(K) U$49.25 U$54.10(V+) U$55.8(V+) U$56.8(V+) U$58.8(V+) U$61.8(V+) U$62.8(V+) U$65.8(V+) U$73.8(V+) U$78.8(V+) U$82.8(V+) U$83.16(V+) U$84.8(V+) U$85.8(V+) U$87.8(V+) U$88.8(V+) U$89.4(VDD) U$90.10(V+) U$91.8(V+) U$93.8(V+) U$94.8(V+) U$96.8(V+) VCO1_FINE1.3(E) VCO1_FINE2.3(E) VCO1_FINE.3(E) VR9.3(E) VR10.3(E) VR15.1(CCW) VR18.1(CCW) VR20.1(CCW) VR21.3(E)
-12V: C4.1 C8.2 C12.1 C16.1 C20.1 C71.1 C72.1 C74.1 R14.1 R98.2 R108.1 R109.1 R110.1 R112.1 R128.2 R131.2 R146.2 R148.2 R157.2 R159.2 R258.2 U$1.8 U$2.8 U$3.4(V-) U$4.4(V-) U$6.4(V-) U$7.8 U$37.4(V-) U$39.4(V-) U$42.4(V-) U$45.2 U$49.26 U$54.6(V-) U$55.4(V-) U$56.4(V-) U$58.4(V-) U$61.4(V-) U$78.4(V-) U$82.4(V-) U$83.8(V-) U$84.4(V-) U$85.4(V-) U$87.4(V-) U$88.4(V-) U$89.7(VSS) U$90.6(V-) U$91.4(V-) VCO1_FINE1.1(A) VCO1_FINE2.1(A) VCO1_FINE.1(A) VR9.1(A)
A_IN_O2B1: R247.2 R248.1 U$54.2(IN1)
A_IN_O2B2: R90.2 R91.1 U$90.2(IN1)
AMP_ENV_OUT: U$84.1(OUT) VR19.1(CCW) VR23.3(E)
AREF_-2.1: C51.1 C52.1 IC13.2(A) R248.2 R251.2 R258.1
AREF_-2.2: C68.1 C69.1 IC2.2(A) R91.2 R94.2 R98.1
AUDIO_CV_EXT: R215.1 U$49.13
AUDIO_EXT: R228.2 U$49.16
CLK_EXT: R230.2 U$49.19
CLK_LED: U17.10 U$53.C
CUTOFF_EXT: R219.2 U$49.21
DWAD: R126.2 U$85.7(OUT) VR16.3(CW)
ENCODER_A: U3.13(PB1) U$48.A
ENCODER_B: U3.12(PB0) U$48.B
ENCODER_BUTTON: U3.11(PD7) U$48.1
ENV_OUT: R106.2 R232.2 U$5.2 U$84.3(+IN)
FB2P: C8.1 R2.1 R14.2 U16.4(FB2P)
FILTER_LFO: R290.2 VR31.2(WIPER)
FILTER_OUT: C29.1 R85.2 R253.2 U$42.1(OUT)
FREQ_LFO: R286.2 R288.2 R289.2 VR24.2(WIPER)
GATE: C36.2 R107.2 U3.10(PD6) U$5.4
GATE_EXT: R231.2 U$49.20
GND: ATTACK.1(A) C1.1 C2.2 C4.2 C5.2 C6.1 C10.2 C12.2 C13.2 C14.1 C15.2 C16.2 C17.2 C18.2 C20.2 C21.2 C25.2 C28.2 C35.2 C37.2 C40.2 C41.2 C42.2 C44.2 C45.2 C46.2 C47.2 C48.2 C49.2 C51.2 C52.2 C62.2 C63.2 C64.2 C65.2 C67.2 C68.2 C69.2 C70.2 C71.2 C72.2 C73.2 C74.2 C75.2 C76.2 C77.2 C79.2 C80.2 DECAY.1(A) IC2.1(C) IC13.1(C) J2.1 J3.1 J4.1(GND) J4.12(GND) Q2.C(S) Q3.C(S) R1.2 R6.2 R9.2 R10.1 R11.1 R29.2 R31.2 R32.1 R33.1 R36.1 R46.1 R60.1 R68.1 R71.2 R72.1 R73.1 R84.2 R88.1 R89.1 R92.1 R101.2 R102.1 R103.1 R107.1 R127.1 R129.1 R130.1 R134.2 R136.1 R137.1 R143.1 R144.1 R147.1 R150.2 R154.1 R155.2 R156.1 R158.1 R161.2 R174.1 R181.1 R229.1 R244.1 R249.1 R285.1 R287.1 R291.1 R295.2 R296.1 R297.2 R298.2 R299.2 R300.1 R301.2 R302.2 R303.2 R304.2 R305.2 RELEASE.1(A) SUSTAIN.1(A) SV2.6 T1.2(E) U1.5(VREFL) U1.6(GND) U1.13(A0) U1.14(A1) U1.15(!ENABLE) U1.16(LDAC) U2.5(GND) U3.3(GND_2) U3.5(GND_3) U3.21(GND) U4.9(GND) U4.23(A1) U4.24(A2) U5.9(GND) U5.18(A0) U5.24(A2) U16.5(FB2N) U16.11(EP) U17.9(GND) U17.24(A2) U19.2(CATHODE) U20.2(CATHODE) U21.2(CATHODE) U$1.15 U$1.16 U$1.20 U$2.15 U$2.16 U$2.20 U$3.3(+IN) U$3.5(+IN) U$3.8(V+) U$4.3(+IN) U$4.5(+IN) U$4.8(V+) U$5.7 U$5.14 U$6.3(+IN) U$6.5(+IN) U$6.8(V+) U$7.15 U$7.16 U$7.17 U$7.19 U$7.20 U$9.1 U$10.1 U$11.1 U$12.1 U$13.1 U$14.1 U$15.1 U$16.1 U$17.1 U$18.1 U$21.1 U$22.1 U$23.1 U$24.1 U$25.1 U$26.1 U$27.1 U$28.1 U$29.1 U$30.1 U$31.1 U$32.1 U$33.1 U$34.1 U$36.1(EMIT_OUT) U$36.4(VCC-) U$37.3(+IN) U$38.1(EMIT_OUT) U$38.4(VCC-) U$39.3(+IN) U$42.3(+IN) U$42.5(+IN) U$47.1(K) U$48.2 U$48.COM U$49.23 U$49.24 U$54.5(GND) U$55.3(+IN) U$55.5(+IN) U$56.3(+IN) U$56.6(-IN) U$58.3(+IN) U$58.5(+IN) U$59.1 U$61.3(+IN) U$61.5(+IN) U$62.4(V-) U$62.5(+IN) U$63.4(V-) U$63.5(+IN) U$64.4(V-) U$64.5(+IN) U$65.4(V-) U$65.5(+IN) U$66.1 U$67.1 U$68.1 U$69.4(V-) U$69.5(+IN) U$70.4(V-) U$70.5(+IN) U$71.P$3(O1) U$72.P$3(O1) U$73.4(V-) U$73.5(+IN) U$74.P$2 U$75.4(V-) U$75.5(+IN) U$76.4(V-) U$76.5(+IN) U$82.3(+IN) U$82.5(+IN) U$83.9(GND) U$84.5(+IN) U$85.5(+IN) U$86.P$3(A) U$86.P$6(A) U$87.5(+IN) U$88.3(+IN) U$88.5(+IN) U$89.3(GND) U$90.5(GND) U$91.5(+IN) U$93.3(+IN) U$93.4(V-) U$93.5(+IN) U$94.3(+IN) U$94.4(V-) U$94.5(+IN) U$96.3(+IN) U$96.4(V-) U$96.5(+IN) U$105.2(GND) U$106.2(GND) U$107.2(GND) U$108.2(GND) U$109.2(GND) U$110.2(GND) U$111.1(GND) U$111.9(PAD) VR2.1(A) VR3.1(A) VR4.1(A) VR5.3 VR6.1(A) VR8.1(A) VR10.1(A) VR11.1(A) VR12.1(A) VR14.3 VR15.3(CW) VR16.1(CCW) VR17.1(A) VR18.3(CW) VR19.3(CW) VR20.3(CW) VR21.1(A) VR23.1(A) VR25.1(A) VR26.1(A) VR27.1(A) VR28.3 VR30.1(CCW) VR31.1(CCW) Y1.2(GND) Y1.4(GND)
HS_OSC2: C59.2 U$51.P$3(O1)
HS_OSC3: C61.2 U$57.P$3(O1)
LED_1: U17.1(P00) U$104.C
LED_2: U17.2(P01) U$103.C
LED_3: U17.3(P02) U$102.C
LED_4: U17.4(P03) U$101.C
LED_5: U17.5(P04) U$100.C
LED_6: U17.6(P05) U$99.C
LED_7: U17.7(P06) U$98.C
LED_8: U17.8(P07) U$97.C
LFO_OUT: C26.2 R77.1 U$79.P$2(COMMON1) U$80.P$2(COMMON1) U$81.P$2(COMMON1) U$82.7(OUT)
LFO_PWM: R21.1 R22.1 R23.1 U$79.P$1(S1)
LFO_RAW: R97.2 R171.1 U$77.P$2(COMMON1)
LIN_FREQ_2: R20.2 R58.2 R288.1 U$1.21
LIN_FREQ_3: R42.2 R66.2 R289.1 U$2.21
MIDI_RX: R69.1 U2.6(VOUT) U3.30(PD0)
MIDI_TX: R173.1 U3.31(PD1)
MISO: SV2.1 U3.16(PB4)
MIX2_OUT: R204.1 U$58.7(OUT) U$83.1(SIG+)
MOD_AMOUNT: R99.1 VR16.2(WIPER)
MOD_CV_DAC_OUT: R165.1 R182.2 R188.2
MOSI: SV2.4 U1.11(DIN) U3.15(PB3)
N$1: R5.2 U$7.9
N$2: C30.2 U$8.P$1(S1)
N$3: C57.2 U$40.P$1(S1)
N$4: R116.2 R286.1 U$7.21
N$5: U$7.22 VR1.1
N$6: R7.2 VR1.2 VR1.3
N$7: U$84.2(-IN) VR19.2(WIPER)
N$8: R6.1 R8.1 U$1.28
N$9: U$8.P$3(O1) U$35.P$2(COMMON1)
N$10: U$7.6 VR5.1
N$11: R210.1 U$2.26
N$12: R27.1 U$53.A
N$13: R75.2 VR5.2
N$14: U$40.P$3(O1) U$41.P$2(COMMON1)
N$15: R10.2 R12.2 U$1.2
N$16: C11.2 R12.1
N$17: C11.1 U$1.1 U$1.31
N$18: R132.2 R145.2 R151.1 U$78.7(OUT)
N$19: R17.2 U$1.9
N$20: R18.2 U$1.10
N$21: R19.2 U$1.11
N$22: C13.1 U$1.14
N$23: R54.1 U$97.A
N$24: U$93.6(-IN) U$93.7(OUT)
N$25: U$1.22 VR7.1
N$26: R29.1 R30.1 U$2.28
N$27: R24.2 R26.1 U$3.1(OUT)
N$28: R28.2 VR7.2 VR7.3
N$29: U$65.3(+IN) U$105.4(COM)
N$30: R24.1 R25.2 U$93.2(-IN)
N$31: R199.1 R200.1 R201.1 R202.2 U$58.2(-IN)
N$32: R170.2 U$74.P$1
N$33: R11.2 U$1.3
N$34: U$43.P$1(S1) U$51.P$2(COMMON1)
N$35: C44.1 R2.2 U16.2(FB1P) U16.3(VREF)
N$36: U$1.6 VR14.1
N$37: R13.2 VR14.2
N$38: U$44.P$1(S1) U$57.P$2(COMMON1)
N$39: U$69.3(+IN) U$106.4(COM)
N$40: C22.2 R47.2 R55.2 R168.2 U$37.2(-IN)
N$41: C14.2 R210.2
N$42: R32.2 R34.2 U$2.2
N$43: C19.2 R34.1
N$44: C19.1 U$2.1 U$2.31
N$45: C9.2 R36.2 R175.1 U16.1(FB1N)
N$46: R39.2 U$2.9
N$47: R40.2 U$2.10
N$48: R41.2 U$2.11
N$49: C21.1 U$2.14
N$50: U$70.3(+IN) U$107.4(COM)
N$51: U$2.22 VR22.1
N$52: R43.2 VR22.2 VR22.3
N$54: R33.2 U$2.3
N$55: C22.1 R56.1 R57.1 R168.1 U$36.3(IN-) U$37.1(OUT)
N$56: U$2.6 VR28.1
N$57: R35.2 VR28.2
N$58: C32.2 R65.2 R208.2 U$39.6(-IN)
N$59: C23.1 R58.1 R209.1 U$37.7(OUT)
N$60: Q3.E(D) R64.2 U$39.5(+IN)
N$61: R51.2 R53.1 U$4.1(OUT)
N$62: R51.1 R52.2 U$94.2(-IN)
N$63: C43.1 R152.1 U$78.1(OUT) U$78.6(-IN)
N$64: R171.2 R194.1 U$88.2(-IN)
N$65: R60.2 R61.1 U$36.2(IN+)
N$66: C24.1 R61.2
N$67: U$62.3(+IN) U$108.4(COM)
N$68: C30.1 R47.1 U$35.P$1(S1)
N$70: R115.1 U$86.P$2(S)
N$71: C31.2 R62.2 R63.2 R169.2 U$39.2(-IN)
N$72: C31.1 R64.1 R65.1 R169.1 U$38.3(IN-) U$39.1(OUT)
N$73: Q2.E(D) R56.2 U$37.5(+IN)
N$74: C32.1 R66.1 R208.1 U$39.7(OUT)
N$75: C23.2 R57.2 R209.2 U$37.6(-IN)
N$76: R68.2 R87.1 U$38.2(IN+)
N$77: C56.1 R87.2
N$79: C57.1 R62.1 U$41.P$1(S1)
N$80: R1.1 R70.1 U$7.28
N$81: R211.1 U$1.26
N$83: R72.2 R74.2 U$7.2
N$86: C3.2 R74.1
N$88: C3.1 U$7.1 U$7.31
N$91: C7.1 U16.6(SW2) U$20.1
N$93: R78.2 R80.1 U$6.1(OUT)
N$94: R78.1 R79.2 U$96.2(-IN)
N$95: R136.2 R139.2 U$78.3(+IN)
N$97: D1.1(K) R44.1 U2.2(A)
N$98: D1.2(A) J1.2 U2.3(C)
N$99: R170.1 R194.2 U$88.1(OUT)
N$100: J1.3 R44.2
N$104: U$88.6(-IN) U$88.7(OUT)
N$105: C6.2 R211.2
N$106: R95.2 U$7.10
N$107: R113.2 U$7.11
N$109: C58.1 U$1.19
N$110: R233.1 R234.2 U$91.6(-IN)
N$111: C59.1 R88.2 U$1.17
N$112: R76.1 R82.2 R86.1 R219.1 R290.1 U$42.6(-IN)
N$113: R221.1 U17.23(A1)
N$114: C66.1 R93.1 R94.1 R99.2 R165.2 U$61.2(-IN) U$90.4(OUT1)
N$115: C61.1 R89.2 U$2.17
N$116: C93.1 R256.2 U$54.7(OUT2) U$55.2(-IN)
N$117: R76.2 VR9.2(S)
N$118: C60.1 U$2.19
N$119: U$63.3(+IN) U$109.4(COM)
N$120: U$64.3(+IN) U$110.4(COM)
N$121: U$62.6(-IN) U$62.7(OUT)
N$122: U$63.6(-IN) U$63.7(OUT)
N$123: U$64.6(-IN) U$64.7(OUT)
N$124: U$65.6(-IN) U$65.7(OUT)
N$125: U$69.6(-IN) U$69.7(OUT)
N$126: U$70.6(-IN) U$70.7(OUT)
N$127: R117.1 U$86.P$5(S)
N$128: C5.1 U$7.14
N$129: R81.1 U$98.A
N$130: R117.2 R119.1 U$85.2(-IN)
N$131: U$73.6(-IN) U$73.7(OUT)
N$132: U$75.6(-IN) U$75.7(OUT)
N$133: U$76.6(-IN) U$76.7(OUT)
N$134: C65.1 R90.1
N$135: R92.2 VR29.3(CW)
N$136: U$90.3(VC1) VR29.2(WIPER)
N$137: C66.2 U$61.1(OUT) U$90.8(VC2) VR29.1(CCW)
N$138: C67.1 R96.1
N$139: C27.1 R166.2 U$82.2(-IN) U$90.7(OUT2)
N$140: C55.1 U$83.6(C3A)
N$141: R96.2 R97.1 U$90.9(IN2)
N$142: R119.2 R125.1 U$85.1(OUT)
N$143: R100.1 R101.1 U$5.15
N$144: R106.1 U$5.10
N$145: R102.2 R104.1 U$5.13
N$146: R103.2 R105.1 U$5.12
N$147: R82.1 R83.1 U$42.7(OUT)
N$148: J3.3 R172.2
N$149: C35.1 U$5.1
N$150: C36.1 U$5.5
N$151: C37.1 U$5.8
N$152: C7.2 U$45.1 U$47.2(A)
N$153: J3.2 R173.2
N$154: R108.2 U$5.6
N$155: ATTACK.3(E) R109.2
N$156: DECAY.3(E) R110.2
N$157: R111.2 SUSTAIN.3(E)
N$158: R112.2 RELEASE.3(E)
N$159: ATTACK.2(S) R100.2
N$160: DECAY.2(S) R105.2
N$161: SUSTAIN.2(S) U$5.9
N$162: R104.2 RELEASE.2(S)
N$163: R205.2 R232.1 U$91.2(-IN)
N$164: R115.2 R118.1 U$87.2(-IN)
N$165: U$84.6(-IN) U$84.7(OUT)
N$166: R223.1 U$7.26
N$167: U$80.P$1(S1) VR24.3(CW)
N$168: C1.2 R223.2
N$169: C34.1 IC1.2(A:-IN) R183.1 R224.2
N$170: R73.2 U$7.3
N$171: R93.2 VR17.2(S)
N$172: R118.2 R120.1 U$87.1(OUT)
N$173: R120.2 R124.1 U$87.6(-IN)
N$174: R114.1 U$99.A
N$175: R124.2 U$87.7(OUT) VR30.3(CW)
N$176: R125.2 R126.1 U$85.6(-IN)
N$177: C39.1 IC1.13(D:-IN) R185.1 R227.2
N$178: C43.2 R135.2 R141.2 U$78.2(-IN)
N$179: R250.2 VR23.2(S)
N$180: 1_DOWN.P$2(COMMON1) R127.2 R128.1
N$181: C38.1 IC1.9(C:-IN) R184.1 R225.2
N$182: C41.1 U3.7(PB6) Y1.3
N$183: C33.1 IC1.6(B:-IN) R182.1 R226.2
N$184: C40.1 U3.8(PB7) Y1.1
N$185: R129.2 R131.1 U$92.P$2(COMMON1)
N$186: U16.10(SW1) U$19.2 U$46.2(A)
N$187: C79.1 R247.1
N$188: 1_UP.P$5(COMMON1) R133.2 R134.1
N$189: R142.1 R143.2 U$92.P$5(COMMON1)
N$190: R135.1 R139.1 VR21.2(S)
N$191: 1_UP.P$2(COMMON1) U$92.P$4(S1)
N$192: 1_DOWN.P$5(COMMON1) U$92.P$1(S1)
N$193: R202.1 R203.2 U$58.1(OUT)
N$194: R141.1 T1.3(C)
N$195: C55.2 U$83.7(C3B)
N$196: R145.1 T1.1(B)
N$197: C53.1 U$83.13(C1A)
N$198: 1_DOWN.P$1(S1) R197.2
N$199: 1_DOWN.P$4(S1) R198.2
N$200: R121.1 U$100.A
N$201: R122.1 U$101.A
N$202: R130.2 R132.1 U$78.5(+IN)
N$203: C53.2 U$83.12(C1B)
N$204: R151.2 R155.1 U$77.P$1(S1)
N$205: C50.1 U$83.11(C2A)
N$206: R152.2 U$77.P$3(O1)
N$207: C50.2 U$83.10(C2B)
N$208: 1_UP.P$1(S1) R206.2
N$209: 1_UP.P$4(S1) R207.2
N$210: 2_DOWN.P$2(COMMON1) R144.2 R146.1
N$211: R147.2 R148.1 U$60.P$2(COMMON1)
N$212: R123.1 U$102.A
N$213: 2_UP.P$5(COMMON1) R149.2 R150.1
N$214: R163.1 U$103.A
N$215: R153.1 R154.2 U$60.P$5(COMMON1)
N$216: R164.1 U$104.A
N$217: 2_UP.P$2(COMMON1) U$60.P$4(S1)
N$218: R45.1 R46.2 U$85.3(+IN) U$87.3(+IN)
N$219: C34.2 IC1.1(A:OUT) R189.1
N$220: C33.2 IC1.7(B:OUT) R188.1
N$221: C38.2 IC1.8(C:OUT) R187.1
N$222: C39.2 IC1.14(D:OUT) R186.1
N$223: R297.1 U5.12
N$224: R298.1 U5.11
N$225: R299.1 U5.10
N$226: R300.2 U5.8(P07)
N$227: R243.1 R244.2 U$91.3(+IN)
N$228: R295.1 U4.12
N$229: R228.1 R229.2 U$7.4
N$230: U$81.P$1(S1) VR31.3(CW)
N$231: R296.2 U4.8(P07)
N$232: R230.1 U3.1(PD3)
N$233: R231.1 U3.2(PD4)
N$234: U$3.6(-IN) U$3.7(OUT)
N$235: U$94.6(-IN) U$94.7(OUT)
N$236: C26.1 R77.2 R167.1 U$82.6(-IN)
N$237: C27.2 R166.1 R167.2 U$82.1(OUT)
N$238: U$61.6(-IN) U$61.7(OUT)
N$239: U$4.6(-IN) U$4.7(OUT)
N$240: U$6.6(-IN) U$6.7(OUT)
N$241: U$96.6(-IN) U$96.7(OUT)
N$242: R291.2 VR24.1(CCW)
N$243: R220.1 U17.18(A0)
N$244: R222.1 U5.23(A1)
N$245: R292.1 U4.18(A0)
N$246: R83.2 R84.1 U$83.15(FREQCTRL)
N$247: C54.1 U$83.4(C4A)
N$248: C54.2 U$83.5(C4B)
N$249: R137.2 U$83.2(SIG-)
N$250: R138.1 R140.1 U$83.14(QCTRL)
N$251: C47.1 R138.2
N$252: C29.2 R85.1 U$42.2(-IN) U$83.3(OUT)
N$253: 2_DOWN.P$5(COMMON1) U$60.P$1(S1)
N$254: 2_DOWN.P$1(S1) R192.2
N$255: 2_DOWN.P$4(S1) R193.2
N$256: 2_UP.P$1(S1) R195.2
N$257: 2_UP.P$4(S1) R196.2
N$258: 3_DOWN.P$2(COMMON1) R156.2 R157.1
N$259: R158.2 R159.1 U$95.P$2(COMMON1)
N$260: 3_UP.P$5(COMMON1) R160.2 R161.1
N$261: R162.1 R174.2 U$95.P$5(COMMON1)
N$262: 3_UP.P$2(COMMON1) U$95.P$4(S1)
N$263: 3_DOWN.P$5(COMMON1) U$95.P$1(S1)
N$264: 3_DOWN.P$1(S1) R176.2
N$265: 3_DOWN.P$4(S1) R178.2
N$266: 3_UP.P$1(S1) R190.2
N$267: 3_UP.P$4(S1) R191.2
N$268: R293.1 U$90.1(MODE)
N$269: 1.2K.2 4.3K.1 U$111.3(EN)
N$270: R215.2 U$7.12
N$271: R294.1 U$54.1(MODE)
N$272: R301.1 U17.13
N$273: R302.1 U17.14
N$274: R140.2 VR10.2(S)
N$275: R285.2 U$111.7(ILM)
N$276: R21.2 R26.2 R50.2 R216.1 U$3.2(-IN)
N$277: R22.2 R49.2 R53.2 R217.2 U$4.2(-IN)
N$278: R23.2 R48.2 R80.2 R218.2 U$6.2(-IN)
N$279: R50.1 VR15.2(WIPER)
N$280: R49.1 VR18.2(WIPER)
N$281: R48.1 VR20.2(WIPER)
N$282: 1.2K.1 R287.2 U$111.8(OLVO)
N$283: R303.1 U17.15
N$284: R203.1 R204.2 U$58.6(-IN)
N$285: R304.1 U17.16
N$286: R249.2 VR13.3(CW)
N$287: U$54.3(VC1) VR13.2(WIPER)
N$288: C81.2 U$54.8(VC2) U$56.1(OUT) VR13.1(CCW)
N$289: R305.1 U17.17
N$308: C80.1 R252.1
N$309: C82.1 R255.2 R257.1 U$55.6(-IN)
N$313: C93.2 R256.1 R257.2 U$55.1(OUT)
N$314: R252.2 R253.1 U$54.9(IN2)
N$315: U$56.5(+IN) U$56.7(OUT)
N$316: C81.1 R250.1 R251.1 U$54.4(OUT1) U$56.2(-IN)
N$318: J2.2 J2.3 R254.1
OCT+: R281.2 U4.10 U$67.2
OCT-: R282.2 U4.11 U$68.2
OSC1_DAC: R224.1 U1.1(VOUTA)
OSC1_DAC_OUT: R3.1 R184.2 R187.2
OSC1_FINE: R4.1 VCO1_FINE.2(S)
OSC1_MIX: R201.2 U$35.P$3(O1)
OSC1_OCT: R3.2 R4.2 R75.1 R197.1 R198.1 R206.1 R207.1 R212.2 R237.2 U$7.7
OSC1_OUT: R71.1 U$7.25 U$8.P$2(COMMON1) U$43.P$2(COMMON1)
OSC2_DAC: R226.1 U1.2(VOUTB)
OSC2_DAC_OUT: R15.1 R185.2 R186.2
OSC2_FINE: R16.1 VCO1_FINE1.2(S)
OSC2_MIX: R200.2 U$41.P$3(O1)
OSC2_OCT: R13.1 R15.2 R16.2 R192.1 R193.1 R195.1 R196.1 R213.2 R238.2 U$1.7
OSC2_OUT: R9.1 U$1.25 U$40.P$2(COMMON1) U$44.P$2(COMMON1)
OSC3_DAC: R225.1 U1.7(VOUTC)
OSC3_DAC_OUT: R37.1 R183.2 R189.2
OSC3_FINE: R38.1 VCO1_FINE2.2(S)
OSC3_OCT: R35.1 R37.2 R38.2 R176.1 R178.1 R190.1 R191.1 R214.2 R239.2 U$2.7
OSC3_OUT: R31.1 R199.2 U$2.25
OUT5: C82.2 R254.2 R255.1 U$55.7(OUT)
PITCH_BEND: R237.1 R238.1 R239.1 VR30.2(WIPER)
PULSE_BUF_OSC1: R113.1 U$76.1(OUT) U$76.2(-IN)
PULSE_OSC1: U$76.3(+IN) U$107.1(NO) U$110.1(NO) VR4.2(S)
PULSE_OSC2: R19.1 U$70.1(OUT) U$70.2(-IN)
PULSE_OSC2_POT: U$107.3(NC) VR12.2(S)
PULSE_OSC3: R41.1 U$64.1(OUT) U$64.2(-IN)
PULSE_OSC3_POT: U$110.3(NC) VR27.2(S)
PWM_1: R25.1 U$7.32 U$93.1(OUT)
PWM_1_EXT: R216.2 U$49.14
PWM_2: R52.1 U$1.32 U$94.1(OUT)
PWM_2_EXT: R217.1 U$49.11
PWM_3: R79.1 U$2.32 U$96.1(OUT)
PWM_3_EXT: R218.1 U$49.12
RESET: SV2.5 U3.29(PC6)
SAW_BUF_OSC1: R95.1 U$75.1(OUT) U$75.2(-IN)
SAW_OSC1: U$75.3(+IN) U$106.1(NO) U$109.1(NO) VR3.2(S)
SAW_OSC2: R18.1 U$69.1(OUT) U$69.2(-IN)
SAW_OSC2_POT: U$106.3(NC) VR11.2(S)
SAW_OSC3: R40.1 U$63.1(OUT) U$63.2(-IN)
SAW_OSC3_POT: U$109.3(NC) VR26.2(S)
SCK: SV2.3 U1.10(SCLK) U3.17(PB5)
SCL: R242.1 U3.28(PC5) U4.19(SCL) U5.19(SCL) U17.19(SCL)
SDA: R241.1 U3.27(PC4) U4.20(SDA) U5.20(SDA) U17.20(SDA)
SEQ_BUTTON_1: R283.2 U17.12 U$59.2
SEQ_BUTTON_2: R284.2 U17.11 U$66.2
SS1: C18.1 R177.2 U16.9(~SHDN/SS1)
SS2: C25.1 R179.2 U16.7(~SHDN/SS2)
SS_OSC2: C58.2 U$51.P$1(S1)
SS_OSC3: C60.2 U$57.P$1(S1)
SW1: R245.2 U4.15 U$9.2
SW2: R246.2 U4.17 U$10.2
SW3: R259.2 U4.14 U$11.2
SW4: R260.2 U4.16 U$12.2
SW5: R261.2 U4.13 U$13.2
SW6: R262.2 U4.7(P06) U$14.2
SW7: R263.2 U4.3(P02) U$15.2
SW8: R264.2 U4.6(P05) U$16.2
SW9: R265.2 U4.2(P01) U$17.2
SW10: R266.2 U4.5(P04) U$18.2
SW11: R267.2 U4.1(P00) U$21.2
SW12: R268.2 U4.4(P03) U$22.2
SW13: R269.2 U5.15 U$23.2
SW14: R270.2 U5.17 U$24.2
SW15: R271.2 U5.14 U$25.2
SW16: R272.2 U5.16 U$26.2
SW17: R273.2 U5.13 U$27.2
SW18: R274.2 U5.7(P06) U$28.2
SW19: R275.2 U5.3(P02) U$29.2
SW20: R276.2 U5.6(P05) U$30.2
SW21: R277.2 U5.2(P01) U$31.2
SW22: R278.2 U5.5(P04) U$32.2
SW23: R279.2 U5.1(P00) U$33.2
SW24: R280.2 U5.4(P03) U$34.2
SYNC: U1.9(!SYNC) U3.14(PB2)
TIME_REVERSAL_2: C24.2 Q2.B(G) R59.2 U$1.18 U$36.7(COL_OUT)
TIME_REVERSAL_3: C56.2 Q3.B(G) R67.2 U$2.18 U$38.7(COL_OUT)
TRI_BUF_OSC1: R5.1 U$73.1(OUT) U$73.2(-IN)
TRI_OSC1: U$73.3(+IN) U$105.1(NO) U$108.1(NO) VR2.2(S)
TRI_OSC2: R17.1 U$65.1(OUT) U$65.2(-IN)
TRI_OSC2_POT: U$105.3(NC) VR8.2(S)
TRI_OSC3: R39.1 U$62.1(OUT) U$62.2(-IN)
TRI_OSC3_POT: U$108.3(NC) VR25.2(S)
V/OCT_1_EXT: R212.1 U$49.17
V/OCT_2_EXT: R213.1 U$49.18
V/OCT_3_EXT: R214.1 U$49.15
VCF_CV_DAC: R227.1 U1.8(VOUTD)
VCF_ENV: U$89.1(D) VR6.3(E)
VCF_ENV_INVERT_SEL: U$72.P$2(COMMON1) U$89.6(SEL)
VCF_ENV_POT_OUT: R86.2 VR6.2(S)
VCF_ENV_S1: R205.1 R233.2 U$89.2(S1) U$91.1(OUT)
VCF_ENV_S2: R234.1 U$89.8(S2) U$91.7(OUT)
VOICE_SYNC: U$71.P$2(COMMON1) U$105.6(S) U$106.6(S) U$107.6(S) U$108.6(S) U$109.6(S) U$110.6(S)
VREF: R180.2 U1.3(VREFH/VREFOUT)
Unconnected: 1_DOWN.P$3(O1) 1_DOWN.P$6(O1) 1_UP.P$3(O1) 1_UP.P$6(O1) 2_DOWN.P$3(O1) 2_DOWN.P$6(O1) 2_UP.P$3(O1) 2_UP.P$6(O1) 3_DOWN.P$3(O1) 3_DOWN.P$6(O1) 3_UP.P$3(O1) 3_UP.P$6(O1) J1.1 J1.4 J2.4 J3.4 J4.3(CC1) J4.4(SBU2) J4.5(D-) J4.6(D+) J4.7(D+) J4.8(D-) J4.9(CC2) J4.10(SBU1) J4.S1(SHIELD) J4.S2(SHIELD) J4.S3(SHIELD) J4.S4(SHIELD) J4.S5(SHIELD) J4.S6(SHIELD) U2.7(EN) U3.9(PD5) U3.19(ADC6) U3.20(AREF) U3.22(ADC7) U3.23(PC0) U3.24(PC1) U3.25(PC2) U3.26(PC3) U3.32(PD2) U3.33(EP) U4.22(!INT) U4.25(EP) U5.22(!INT) U5.25(EP) U17.22(!INT) U17.25(EP) U19.3(NC) U20.3(NC) U21.3(NC) U$1.4 U$1.5 U$1.12 U$1.13 U$1.24 U$1.29 U$1.30 U$2.4 U$2.5 U$2.12 U$2.13 U$2.24 U$2.29 U$2.30 U$5.3 U$5.16 U$7.5 U$7.13 U$7.18 U$7.24 U$7.29 U$7.30 U$8.P$4(S1) U$8.P$5(COMMON1) U$8.P$6(O1) U$9.3 U$9.4 U$9.5 U$9.6 U$10.3 U$10.4 U$10.5 U$10.6 U$11.3 U$11.4 U$11.5 U$11.6 U$12.3 U$12.4 U$12.5 U$12.6 U$13.3 U$13.4 U$13.5 U$13.6 U$14.3 U$14.4 U$14.5 U$14.6 U$15.3 U$15.4 U$15.5 U$15.6 U$16.3 U$16.4 U$16.5 U$16.6 U$17.3 U$17.4 U$17.5 U$17.6 U$18.3 U$18.4 U$18.5 U$18.6 U$21.3 U$21.4 U$21.5 U$21.6 U$22.3 U$22.4 U$22.5 U$22.6 U$23.3 U$23.4 U$23.5 U$23.6 U$24.3 U$24.4 U$24.5 U$24.6 U$25.3 U$25.4 U$25.5 U$25.6 U$26.3 U$26.4 U$26.5 U$26.6 U$27.3 U$27.4 U$27.5 U$27.6 U$28.3 U$28.4 U$28.5 U$28.6 U$29.3 U$29.4 U$29.5 U$29.6 U$30.3 U$30.4 U$30.5 U$30.6 U$31.3 U$31.4 U$31.5 U$31.6 U$32.3 U$32.4 U$32.5 U$32.6 U$33.3 U$33.4 U$33.5 U$33.6 U$34.3 U$34.4 U$34.5 U$34.6 U$35.P$4(S1) U$35.P$5(COMMON1) U$35.P$6(O1) U$36.5(BALANCE) U$36.6(BAL/STRB) U$38.5(BALANCE) U$38.6(BAL/STRB) U$40.P$4(S1) U$40.P$5(COMMON1) U$40.P$6(O1) U$41.P$4(S1) U$41.P$5(COMMON1) U$41.P$6(O1) U$43.P$3(O1) U$43.P$4(S1) U$43.P$5(COMMON1) U$43.P$6(O1) U$44.P$3(O1) U$44.P$4(S1) U$44.P$5(COMMON1) U$44.P$6(O1) U$48.S1(SHIELD) U$48.S2(SHIELD) U$49.1 U$49.2 U$49.3 U$49.4 U$49.5 U$49.6 U$49.7 U$49.8 U$49.9 U$49.10 U$51.P$4(S1) U$51.P$5(COMMON1) U$51.P$6(O1) U$57.P$4(S1) U$57.P$5(COMMON1) U$57.P$6(O1) U$59.3 U$59.4 U$59.5 U$59.6 U$60.P$3(O1) U$60.P$6(O1) U$66.3 U$66.4 U$66.5 U$66.6 U$67.3 U$67.4 U$67.5 U$67.6 U$68.3 U$68.4 U$68.5 U$68.6 U$71.P$4(S1) U$71.P$5(COMMON1) U$71.P$6(O1) U$72.P$4(S1) U$72.P$5(COMMON1) U$72.P$6(O1) U$77.P$4(S1) U$77.P$5(COMMON1) U$77.P$6(O1) U$79.P$3(O1) U$79.P$4(S1) U$79.P$5(COMMON1) U$79.P$6(O1) U$80.P$3(O1) U$80.P$4(S1) U$80.P$5(COMMON1) U$80.P$6(O1) U$81.P$3(O1) U$81.P$4(S1) U$81.P$5(COMMON1) U$81.P$6(O1) U$92.P$3(O1) U$92.P$6(O1) U$95.P$3(O1) U$95.P$6(O1) U$111.2(DVDT) U$111.6(FTK)

## Sheet 2 of 2

## Power pins joined to a net without a drawn wire
+12V: IC1.4(P:V+)
-12V: IC1.11(P:V-)

## Library data of the parts
1.2K 4.3K R1-R305 = rcl:R-US_: RESISTOR, American symbol; SPICEPREFIX: R
1_DOWN 1_UP 2_DOWN 2_UP 3_DOWN 3_UP U$8 U$35 U$40 U$41 U$43 U$44 U$51 U$57 U$60 U$71 U$72 U$77 U$79-U$81 U$92 U$95 = TL2203:TL2203
ATTACK DECAY RELEASE SUSTAIN VCO1_FINE VCO1_FINE1 VCO1_FINE2 VR21 = MusicThingModular:9MM_SNAP-IN_POT_NOSNAP: 9mm vertical snap-in pot, Alpha / Panasonic style
C1-C29 C31-C45 C48-C56 C58-C77 C79-C82 C93 = rcl:C-US: CAPACITOR, American symbol; SPICEPREFIX: C
C30 C57 = rcl:C-US: CAPACITOR, American symbol
C46 = EEE-FK1E100R:EEE-FK1E100R: 10µF 25V Aluminum Electrolytic Capacitors Radial, Can - SMD 2000 Hrs @ 105°C Check prices <https://pricing.snapeda.com/parts/EEE-FK1E100R/Panasonic%20Electronic/view-part?ref=eda>; AVAILABILITY: Good; DESCRIPTION: 10µF 25V Aluminum Electrolytic Capacitors Radial, Can - SMD 2000 Hrs @ 105°C; MF: Panasonic Electronic; MP: EEE-FK1E100R; PACKAGE: Radial Panasonic Electronic; PRICE: None; PURCHASE-URL: https://pricing.snapeda.com/search/part/EEE-FK1E100R/?ref=eda
C47 = rcl:C-EU: CAPACITOR, European symbol; SPICEPREFIX: C
D1 = SamacSys_Parts:TS4148C_RZG: Diodes - General Purpose, Power, Switching 150mW 0.5A HI SPD SWITCHING DIODE Source: Datasheet <http://www.taiwansemi.com/products/datasheet/TS4148C_E1612.pdf>; DESCRIPTION: Diodes - General Purpose, Power, Switching 150mW 0.5A HI SPD SWITCHING DIODE; HEIGHT: 0.75mm; MANUFACTURER_NAME: Taiwan Semiconductor; MANUFACTURER_PART_NUMBER: TS4148C RZG; MOUSER_PART_NUMBER: 821-TS4148C; MOUSER_PRICE-STOCK: https://www.mouser.co.uk/ProductDetail/Taiwan-Semiconductor/TS4148C-RZG?qs=C%2F0tY%2F%2FqZe94zaW%252BCjWDSw%3D%3D
IC1 = linear+tssoptl074:TL074: OP AMP
IC2 IC13 = texas:LM4041: PRECISION MICROPOWER SHUNT VOLTAGE REFERENCE Source: http://focus.ti.com/lit/ds/slcs146e/slcs146e.pdf
J1-J3 = SJ-3524-SMT:SJ-3524-SMT: Audio Jack Connector 3.5 mm Low Profile Surface Mount Stereo Jack, 4 Pin Right-Angle Check prices <https://pricing.snapeda.com/parts/SJ-3524-SMT-TR/CUI%20Devices/view-part?ref=eda>; AVAILABILITY: Good; CUI_PURCHASE_URL: https://www.cuidevices.com/product/interconnect/connectors/audio-connectors/jacks/sj-352x-smt-series?utm_source=snapeda.com&utm_medium=referral&utm_campaign=snapedaBOM; DESCRIPTION: 3.5 mm, Stereo, Right Angle, Surface Mount (SMT), 3 Conductors, 0~1 Internal Switches, Audio Jack Connector; MF: CUI Devices; MP: SJ-3524-SMT-TR; PACKAGE: None; PRICE: None; PURCHASE-URL: https://pricing.snapeda.com/search/part/SJ-3524-SMT-TR/?ref=eda
J4 = DX07S016JA1R1500:DX07S016JA1R1500: USB-C (USB TYPE-C) USB 2.0 Receptacle Connector 24 (16+8 Dummy) Position Surface Mount, Right Angle; Through Hole Check prices <https://pricing.snapeda.com/parts/DX07S016JA1R1500/JAE%20Electronics/view-part?ref=eda>; AVAILABILITY: Warning; DESCRIPTION: USB-C (USB TYPE-C) USB 2.0 Receptacle Connector 24 (16+8 Dummy) Position Surface Mount, Right Angle; Through Hole; MF: JAE Electronics; MP: DX07S016JA1R1500; PACKAGE: None; PRICE: None; PURCHASE-URL: https://pricing.snapeda.com/search/part/DX07S016JA1R1500/?ref=eda
Q2 Q3 = 2N7002:2N7002: Buy Part <https://snapeda.com/parts/2N7002/ON%20Semiconductor/view-part/?ref=eda>
SV2 = pinhead:PINHD-2X3: PIN HEADER
T1 = BC847:BC847: NPN TRANSISTOR; AVAILABILITY: Unavailable; DESCRIPTION: Bipolar (BJT) Transistor NPN 45V 100mA 100MHz 150mW Surface Mount SOT-523; MF: Rectron; MP: BC847; PACKAGE: SOT-523 Rectron; PRICE: None
U1 = DAC8564IAPW:DAC8564IAPW: Check prices <https://pricing.snapeda.com/parts/DAC8564IAPW/Texas%20Instruments/view-part?ref=eda>; AVAILABILITY: Warning; DESCRIPTION: 16-bit, quad channel, ultra-low glitch, vout DAC with 2.5V, 2ppm/C int. ref. with reset to midsca 16-TSSOP -40 to 105; MF: Texas Instruments; MP: DAC8564IAPW; PACKAGE: TSSOP-16 Texas Instruments; PRICE: None; PURCHASE-URL: https://pricing.snapeda.com/search/part/DAC8564IAPW/?ref=eda
U2 = 6N137S:6N137S: Lite-On 6N137 - High Speed Opto Isolator Opto isolator capable of data rates up to 10MBd Check prices <https://pricing.snapeda.com/parts/6N137S/Lite-On%20Electronics/view-part?ref=eda>; AVAILABILITY: Warning; DESCRIPTION: Logic Output Optoisolator 15MBd Open Collector 5000Vrms 1 Channel 10kV/µs CMTI 8-SMD; MF: Lite-On Electronics; MP: 6N137S; PACKAGE: SMD-8 Lite-On Electronics; PRICE: None; PURCHASE-URL: https://pricing.snapeda.com/search/part/6N137S/?ref=eda
U3 = ATMEGA328P-MUR:ATMEGA328P-MUR: Programmable Flash Check prices <https://pricing.snapeda.com/parts/ATMEGA328P-MUR/Microchip/view-part?ref=eda>; AVAILABILITY: Good; DESCRIPTION: AVR AVR® ATmega Microcontroller IC 8-Bit 20MHz 32KB (16K x 16) FLASH 32-VQFN (5x5); MF: Microchip; MP: ATMEGA328P-MUR; PACKAGE: VQFN-32 Microchip Technology; PRICE: None; PURCHASE-URL: https://pricing.snapeda.com/search/part/ATMEGA328P-MUR/?ref=eda
U4 U5 U17 = TCA9535RTWR:TCA9535RTWR: Check prices <https://pricing.snapeda.com/parts/TCA9535RTWR/Texas%20Instruments/view-part?ref=eda>; AVAILABILITY: Good; DESCRIPTION: Remote 16-Bit I2C and SMBus, Low-Power I/O Expander With Interrupt Output and Config Registers 24-WQFN -40 to 85; MF: Texas Instruments; MP: TCA9535RTWR; PACKAGE: WQFN-24 Texas Instruments; PRICE: None; PURCHASE-URL: https://pricing.snapeda.com/search/part/TCA9535RTWR/?ref=eda
U16 = LT3471EDDPBF:LT3471EDDPBF: Dual 1.3A, 1.2MHz Boost/Inverter Check prices <https://pricing.snapeda.com/parts/LT3471EDD%23PBF/Analog%20Devices%20Inc./view-part?ref=eda>; AVAILABILITY: Good; DESCRIPTION: Boost, Cuk, Flyback, SEPIC Switching Regulator IC Positive and Negative (Dual Rail) Adjustable ±1V 2 Output 1.3A 10-WFDFN Exposed Pad; MF: Analog Devices Inc.; MP: LT3471EDD#PBF; PACKAGE: DFN -10 Analog Devices; PRICE: None; PURCHASE-URL: https://pricing.snapeda.com/search/part/LT3471EDD#PBF/?ref=eda
U19-U21 = LM4040:LM4040; AVAILABILITY: Unavailable; DESCRIPTION: Shunt Voltage Reference IC ±0.2% SC-70-5; MF: Texas Instruments; MP: LM4040; PACKAGE: SOT-23-3 Texas Instruments; PRICE: None
U$1 U$2 U$7 = SSI2130:SSI2130_V2
U$3 U$4 U$6 U$61-U$65 U$69 U$70 U$73 U$75 U$76 U$78 U$82 U$84 U$85 U$87 U$91 U$93 U$94 U$96 = LM358QT:LM358QT
U$5 = CEM:AS3310D
U$9-U$18 U$21-U$34 U$59 U$66-U$68 = LT2201:LT2201
U$19 U$20 U$45 = NRS4018T100MDGJ:NRS4018T100MDGJ
U$36 U$38 = LM311:LM311PW
U$37 U$39 U$42 U$55 U$56 U$58 = OPA1652:OPA1652
U$46 U$47 = MBRM120LT3G:MBRM120LT3G
U$48 = PEC11L-4215-S00:PEC11L-4215_S00
U$49 = SFH11-PBPC-D13-RA-BK:SFH11-PBPC-D13-RA-BK
U$53 U$97-U$104 = WP914HDT:WP914HDT
U$54 U$90 = SSI2162:SSI2162
U$74 = WP483SRSGW:WP483SRSGW
U$83 = SSI2144:SSI2144
U$86 = Adafruit psp 2-axis joystick:ADAFRUIT_JOYSTICK
U$88 = MC33178DMR2G:MC33178DMR2G
U$89 = TMUX6219DGKR:TMUX6219DGKR
U$105-U$110 = NC7SB3157P6X:NC7SB3157P6X
U$111 = TPS259620DDAR:TPS259620DDAR
VR1 VR5 VR7 VR14 VR22 VR28 = 3223W-1-501:3223W-1-501: Res Cermet Trimmer 500 Ohm 20% 0.125W(1/8W) 11(Elec)Turns (3.9 X 3.52 X 4.16mm) J-Hook SMD Tube Check prices <https://pricing.snapeda.com/parts/3223W-1-501/Bourns/view-part?ref=eda>; AVAILABILITY: Warning; DESCRIPTION: 500 Ohms 0.125W, 1/8W J Lead Surface Mount Trimmer Potentiometer Cermet 11 Turn Top Adjustment; MF: Bourns; MP: 3223W-1-501; PACKAGE: 3116 Bourns; PRICE: None; PURCHASE-URL: https://pricing.snapeda.com/search/part/3223W-1-501/?ref=eda
VR2-VR4 VR6 VR8-VR12 VR17 VR23 VR25-VR27 = MusicThingModular:9MM_SNAP-IN_POT: 9mm vertical snap-in pot, Alpha / Panasonic style
VR13 VR15 VR16 VR18-VR20 VR24 VR29-VR31 = TC33X-2-103G:TC33X-2-103G: Res Trimmer 10K Ohm 25% 1/10W 1(Elec)/1(Mech)Turn (3 X 3.8mm) Foot Print SMD Embossed T/R; AVAILABILITY: Unavailable; DESCRIPTION: 10 kOhms 0.1W, 1/10W J Lead Surface Mount Trimmer Potentiometer Cermet 1 Turn Top Adjustment; MF: Bourns; MP: TC33X-2-103G; PACKAGE: SOD-23 Bourns; PRICE: None
Y1 = ABM8G-16.000MHZ-18-D2Y-T:ABM8G-16.000MHZ-18-D2Y-T: Crystal 20MHz Â±20ppm (Tol) Â±30ppm (Stability) 18pF FUND 80Ohm 4-Pin Mini-CSMD T/R Check prices <https://pricing.snapeda.com/parts/ABM8G-16.000MHZ-18-D2Y-T/Abracon/view-part?ref=eda>; AVAILABILITY: Good; DESCRIPTION: 16MHz ±20ppm Crystal 18pF 80 Ohms 4-SMD, No Lead; MF: Abracon; MP: ABM8G-16.000MHZ-18-D2Y-T; PACKAGE: SMD-4 Abracon; PRICE: None; PURCHASE-URL: https://pricing.snapeda.com/search/part/ABM8G-16.000MHZ-18-D2Y-T/?ref=eda